# EAGLE design video-max5-sram (EAGLE 5.11)
DRAWN_BY: AlexiosC; PROJECT_NAME: CFT Mini-Computer VDU Card; REVISION: Draft, pre-alpha; SHEET_DESCRIPTION: Frame State Machine; SIMULATION_FILENAME: video.v; URL: http://www.bedroomlan.org/cft

## Sheet 1 of 3
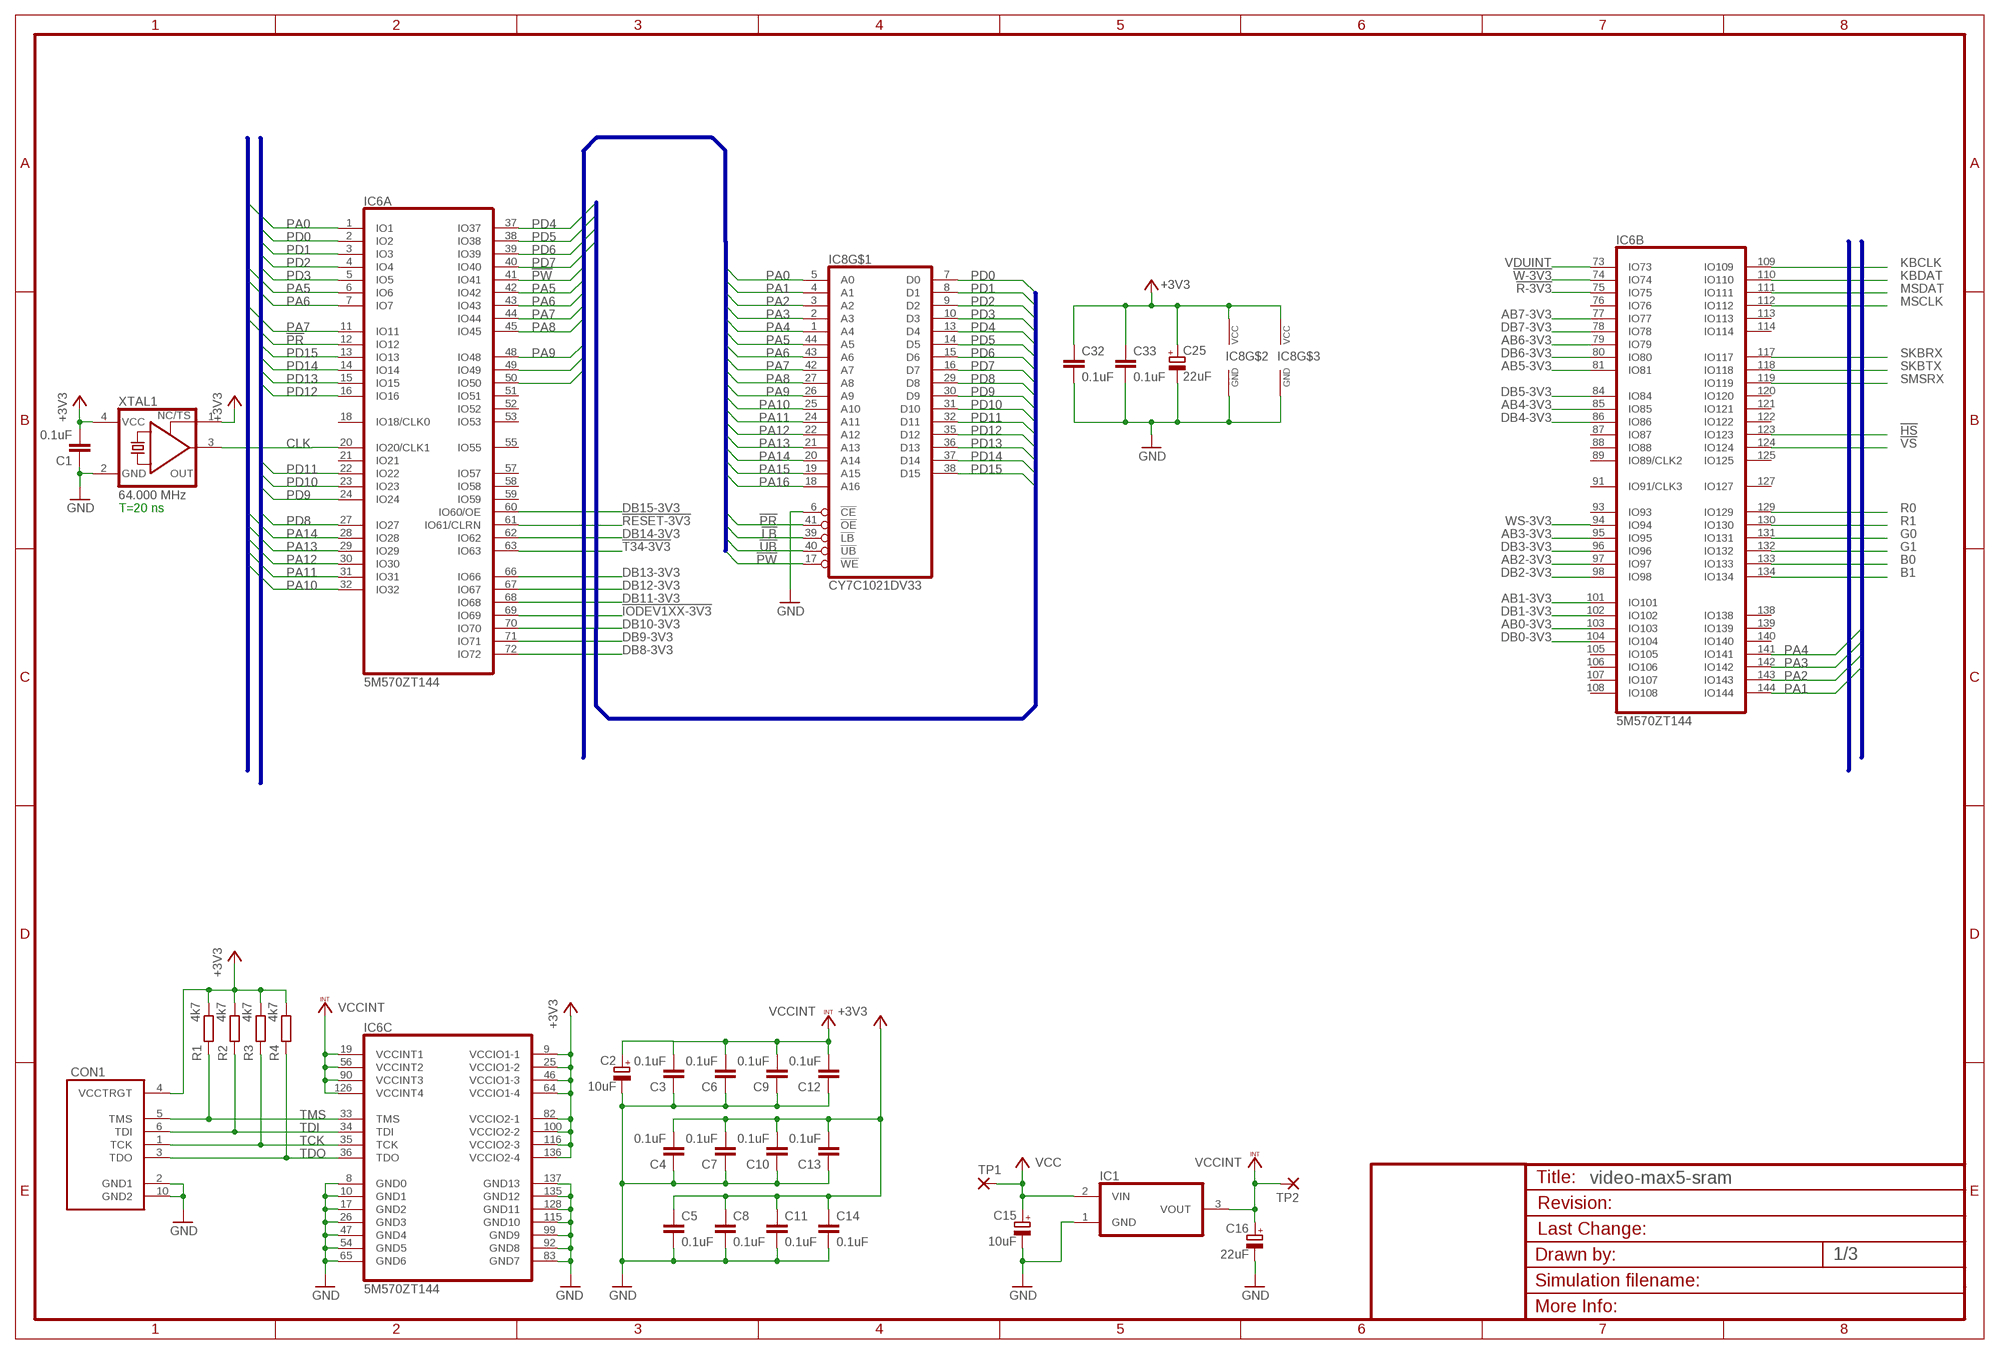
[diagram p0: schematic, sheet 1]

### Parts
C1  0.1uF  C-EUC0805K  [C0805K]
C2  10uF  CPOL-EUE2-5  [E2-5]
C3  0.1uF  C-EUC0805K  [C0805K]
C4  0.1uF  C-EUC0805K  [C0805K]
C5  0.1uF  C-EUC0805K  [C0805K]
C6  0.1uF  C-EUC0805K  [C0805K]
C7  0.1uF  C-EUC0805K  [C0805K]
C8  0.1uF  C-EUC0805K  [C0805K]
C9  0.1uF  C-EUC0805K  [C0805K]
C10  0.1uF  C-EUC0805K  [C0805K]
C11  0.1uF  C-EUC0805K  [C0805K]
C12  0.1uF  C-EUC0805K  [C0805K]
C13  0.1uF  C-EUC0805K  [C0805K]
C14  0.1uF  C-EUC0805K  [C0805K]
C15  10uF  CPOL-EUE2-5  [E2-5]
C16  22uF  CPOL-EUE2-5  [E2-5]
C25  22uF  CPOL-EUE2-5  [E2-5]
C32  0.1uF  C-EUC0805K  [C0805K]
C33  0.1uF  C-EUC0805K  [C0805K]
CON1  JTAG-ALTERA  [SHROUDED-HEADER-2X5-2.5MM]
IC1  AP1117D18  [TO252]
IC6  5M570ZT144  [TQFP144]
IC8  CY7C1021DV33  IS61VL12816L-10T  [TSOP44-T2]
R1  4k7  R-EU_R0805W  [R0805W]
R2  4k7  R-EU_R0805W  [R0805W]
R3  4k7  R-EU_R0805W  [R0805W]
R4  4k7  R-EU_R0805W  [R0805W]
TP1  2,54/0,8  [2,54/0,8]
TP2  2,54/0,8  [2,54/0,8]
XTAL1  64.000 MHz  XO-SMD-5X3.2  [CRYSTAL-SMD-5X3.2MM]

### Nets
!HS: IC6.123(B:IO123) ; also sheet 2
!IODEV1XX-3V3: IC6.69(A:IO69) ; also sheet 2
!LB: IC6.50(A:IO50) IC8.39(!LB)
!PR: IC6.12(A:IO12) IC8.41(!OE)
!PW: IC6.41(A:IO41) IC8.17(!WE)
!R-3V3: IC6.75(B:IO75) ; also sheet 2
!RESET-3V3: IC6.61(A:IO61/CLRN) ; also sheet 2
!T34-3V3: IC6.63(A:IO63)
!UB: IC6.49(A:IO49) IC8.40(!UB)
!VS: IC6.124(B:IO124) ; also sheet 2
!W-3V3: IC6.74(B:IO74) ; also sheet 2
+3V3: C1.2 C4.2 C5.1 C7.2 C8.1 C10.2 C11.1 C13.2 C14.1 C25.+ C32.1 C33.1 CON1.4(VCCTRGT) IC6.9(C:VCCIO1-1) IC6.25(C:VCCIO1-2) IC6.46(C:VCCIO1-3) IC6.64(C:VCCIO1-4) IC6.82(C:VCCIO2-1) IC6.100(C:VCCIO2-2) IC6.116(C:VCCIO2-3) IC6.136(C:VCCIO2-4) IC8.11(VCC) IC8.33(VCC) R1.2 R2.2 R3.2 R4.2 XTAL1.1(TS) XTAL1.4(VCC) ; also sheet 2,3
AB0-3V3: IC6.103(B:IO103) ; also sheet 2
AB1-3V3: IC6.101(B:IO101) ; also sheet 2
AB2-3V3: IC6.97(B:IO97) ; also sheet 2
AB3-3V3: IC6.95(B:IO95) ; also sheet 2
AB4-3V3: IC6.85(B:IO85) ; also sheet 2
AB5-3V3: IC6.81(B:IO81) ; also sheet 2
AB6-3V3: IC6.79(B:IO79) ; also sheet 2
AB7-3V3: IC6.77(B:IO77) ; also sheet 2
B0: IC6.133(B:IO133) ; also sheet 2
B1: IC6.134(B:IO134) ; also sheet 2
CLK: IC6.20(A:IO20/CLK1) XTAL1.3(OUT)
DB0-3V3: IC6.104(B:IO104) ; also sheet 2
DB1-3V3: IC6.102(B:IO102) ; also sheet 2
DB2-3V3: IC6.98(B:IO98) ; also sheet 2
DB3-3V3: IC6.96(B:IO96) ; also sheet 2
DB4-3V3: IC6.86(B:IO86) ; also sheet 2
DB5-3V3: IC6.84(B:IO84) ; also sheet 2
DB6-3V3: IC6.80(B:IO80) ; also sheet 2
DB7-3V3: IC6.78(B:IO78) ; also sheet 2
DB8-3V3: IC6.72(A:IO72) ; also sheet 2
DB9-3V3: IC6.71(A:IO71) ; also sheet 2
DB10-3V3: IC6.70(A:IO70) ; also sheet 2
DB11-3V3: IC6.68(A:IO68) ; also sheet 2
DB12-3V3: IC6.67(A:IO67) ; also sheet 2
DB13-3V3: IC6.66(A:IO66) ; also sheet 2
DB14-3V3: IC6.62(A:IO62) ; also sheet 2
DB15-3V3: IC6.60(A:IO60/OE) ; also sheet 2
G0: IC6.131(B:IO131) ; also sheet 2
G1: IC6.132(B:IO132) ; also sheet 2
GND: C1.1 C2.- C3.1 C4.1 C5.2 C6.1 C7.1 C8.2 C9.1 C10.1 C11.2 C12.1 C13.1 C14.2 C15.- C16.- C25.- C32.2 C33.2 CON1.2(GND1) CON1.10(GND2) IC1.1(GND) IC6.8(C:GND0) IC6.10(C:GND1) IC6.17(C:GND2) IC6.26(C:GND3) IC6.47(C:GND4) IC6.54(C:GND5) IC6.65(C:GND6) IC6.83(C:GND7) IC6.92(C:GND8) IC6.99(C:GND9) IC6.115(C:GND10) IC6.128(C:GND11) IC6.135(C:GND12) IC6.137(C:GND13) IC8.6(!CE) IC8.12(GND) IC8.34(GND) XTAL1.2(GND) ; also sheet 2,3
KBCLK: IC6.109(B:IO109) ; also sheet 2
KBDAT: IC6.110(B:IO110) ; also sheet 2
MSCLK: IC6.112(B:IO112) ; also sheet 2
MSDAT: IC6.111(B:IO111) ; also sheet 2
PA0: IC6.1(A:IO1) IC8.5(A0)
PA1: IC6.144(B:IO144) IC8.4(A1)
PA2: IC6.143(B:IO143) IC8.3(A2)
PA3: IC6.142(B:IO142) IC8.2(A3)
PA4: IC6.141(B:IO141) IC8.1(A4)
PA5: IC6.6(A:IO6) IC6.42(A:IO42) IC8.44(A5)
PA6: IC6.7(A:IO7) IC6.43(A:IO43) IC8.43(A6)
PA7: IC6.11(A:IO11) IC6.44(A:IO44) IC8.42(A7)
PA8: IC6.45(A:IO45) IC8.27(A8)
PA9: IC6.48(A:IO48) IC8.26(A9)
PA10: IC6.32(A:IO32) IC8.25(A10)
PA11: IC6.31(A:IO31) IC8.24(A11)
PA12: IC6.30(A:IO30) IC8.22(A12)
PA13: IC6.29(A:IO29) IC8.21(A13)
PA14: IC6.28(A:IO28) IC8.20(A14)
PA15: IC8.19(A15)
PA16: IC8.18(A16)
PD0: IC6.2(A:IO2) IC8.7(D0)
PD1: IC6.3(A:IO3) IC8.8(D1)
PD2: IC6.4(A:IO4) IC8.9(D2)
PD3: IC6.5(A:IO5) IC8.10(D3)
PD4: IC6.37(A:IO37) IC8.13(D4)
PD5: IC6.38(A:IO38) IC8.14(D5)
PD6: IC6.39(A:IO39) IC8.15(D6)
PD7: IC6.40(A:IO40) IC8.16(D7)
PD8: IC6.27(A:IO27) IC8.29(D8)
PD9: IC6.24(A:IO24) IC8.30(D9)
PD10: IC6.23(A:IO23) IC8.31(D10)
PD11: IC6.22(A:IO22) IC8.32(D11)
PD12: IC6.16(A:IO16) IC8.35(D12)
PD13: IC6.15(A:IO15) IC8.36(D13)
PD14: IC6.14(A:IO14) IC8.37(D14)
PD15: IC6.13(A:IO13) IC8.38(D15)
R0: IC6.129(B:IO129) ; also sheet 2
R1: IC6.130(B:IO130) ; also sheet 2
SKBRX: IC6.117(B:IO117) ; also sheet 2
SKBTX: IC6.118(B:IO118) ; also sheet 2
SMSRX: IC6.119(B:IO119) ; also sheet 2
TCK: CON1.1(TCK) IC6.35(C:TCK) R3.1
TDI: CON1.6(TDI) IC6.34(C:TDI) R2.1
TDO: CON1.3(TDO) IC6.36(C:TDO) R4.1
TMS: CON1.5(TMS) IC6.33(C:TMS) R1.1
VCC: C15.+ IC1.2(VIN) TP1.1(P) ; also sheet 2,3
VCCINT: C2.+ C3.2 C6.2 C9.2 C12.2 C16.+ IC1.3(VOUT) IC6.19(C:VCCINT1) IC6.56(C:VCCINT2) IC6.90(C:VCCINT3) IC6.126(C:VCCINT4) TP2.1(P)
VDUINT: IC6.73(B:IO73) ; also sheet 2
WS-3V3: IC6.94(B:IO94) ; also sheet 2
Unconnected: IC6.18(A:IO18/CLK0) IC6.21(A:IO21) IC6.51(A:IO51) IC6.52(A:IO52) IC6.53(A:IO53) IC6.55(A:IO55) IC6.57(A:IO57) IC6.58(A:IO58) IC6.59(A:IO59) IC6.76(B:IO76) IC6.87(B:IO87) IC6.88(B:IO88) IC6.89(B:IO89/CLK2) IC6.91(B:IO91/CLK3) IC6.93(B:IO93) IC6.105(B:IO105) IC6.106(B:IO106) IC6.107(B:IO107) IC6.108(B:IO108) IC6.113(B:IO113) IC6.114(B:IO114) IC6.120(B:IO120) IC6.121(B:IO121) IC6.122(B:IO122) IC6.125(B:IO125) IC6.127(B:IO127) IC6.138(B:IO138) IC6.139(B:IO139) IC6.140(B:IO140)

### Buses
PD[0..23]
PA[0..15],PB/!PC!,CG/!P!,!PR,!PW
PA[0..16],!PR,!PW,!UB,!LB,!CE1,!CE2

### Notes on the sheet
- T=20 ns

## Sheet 2 of 3
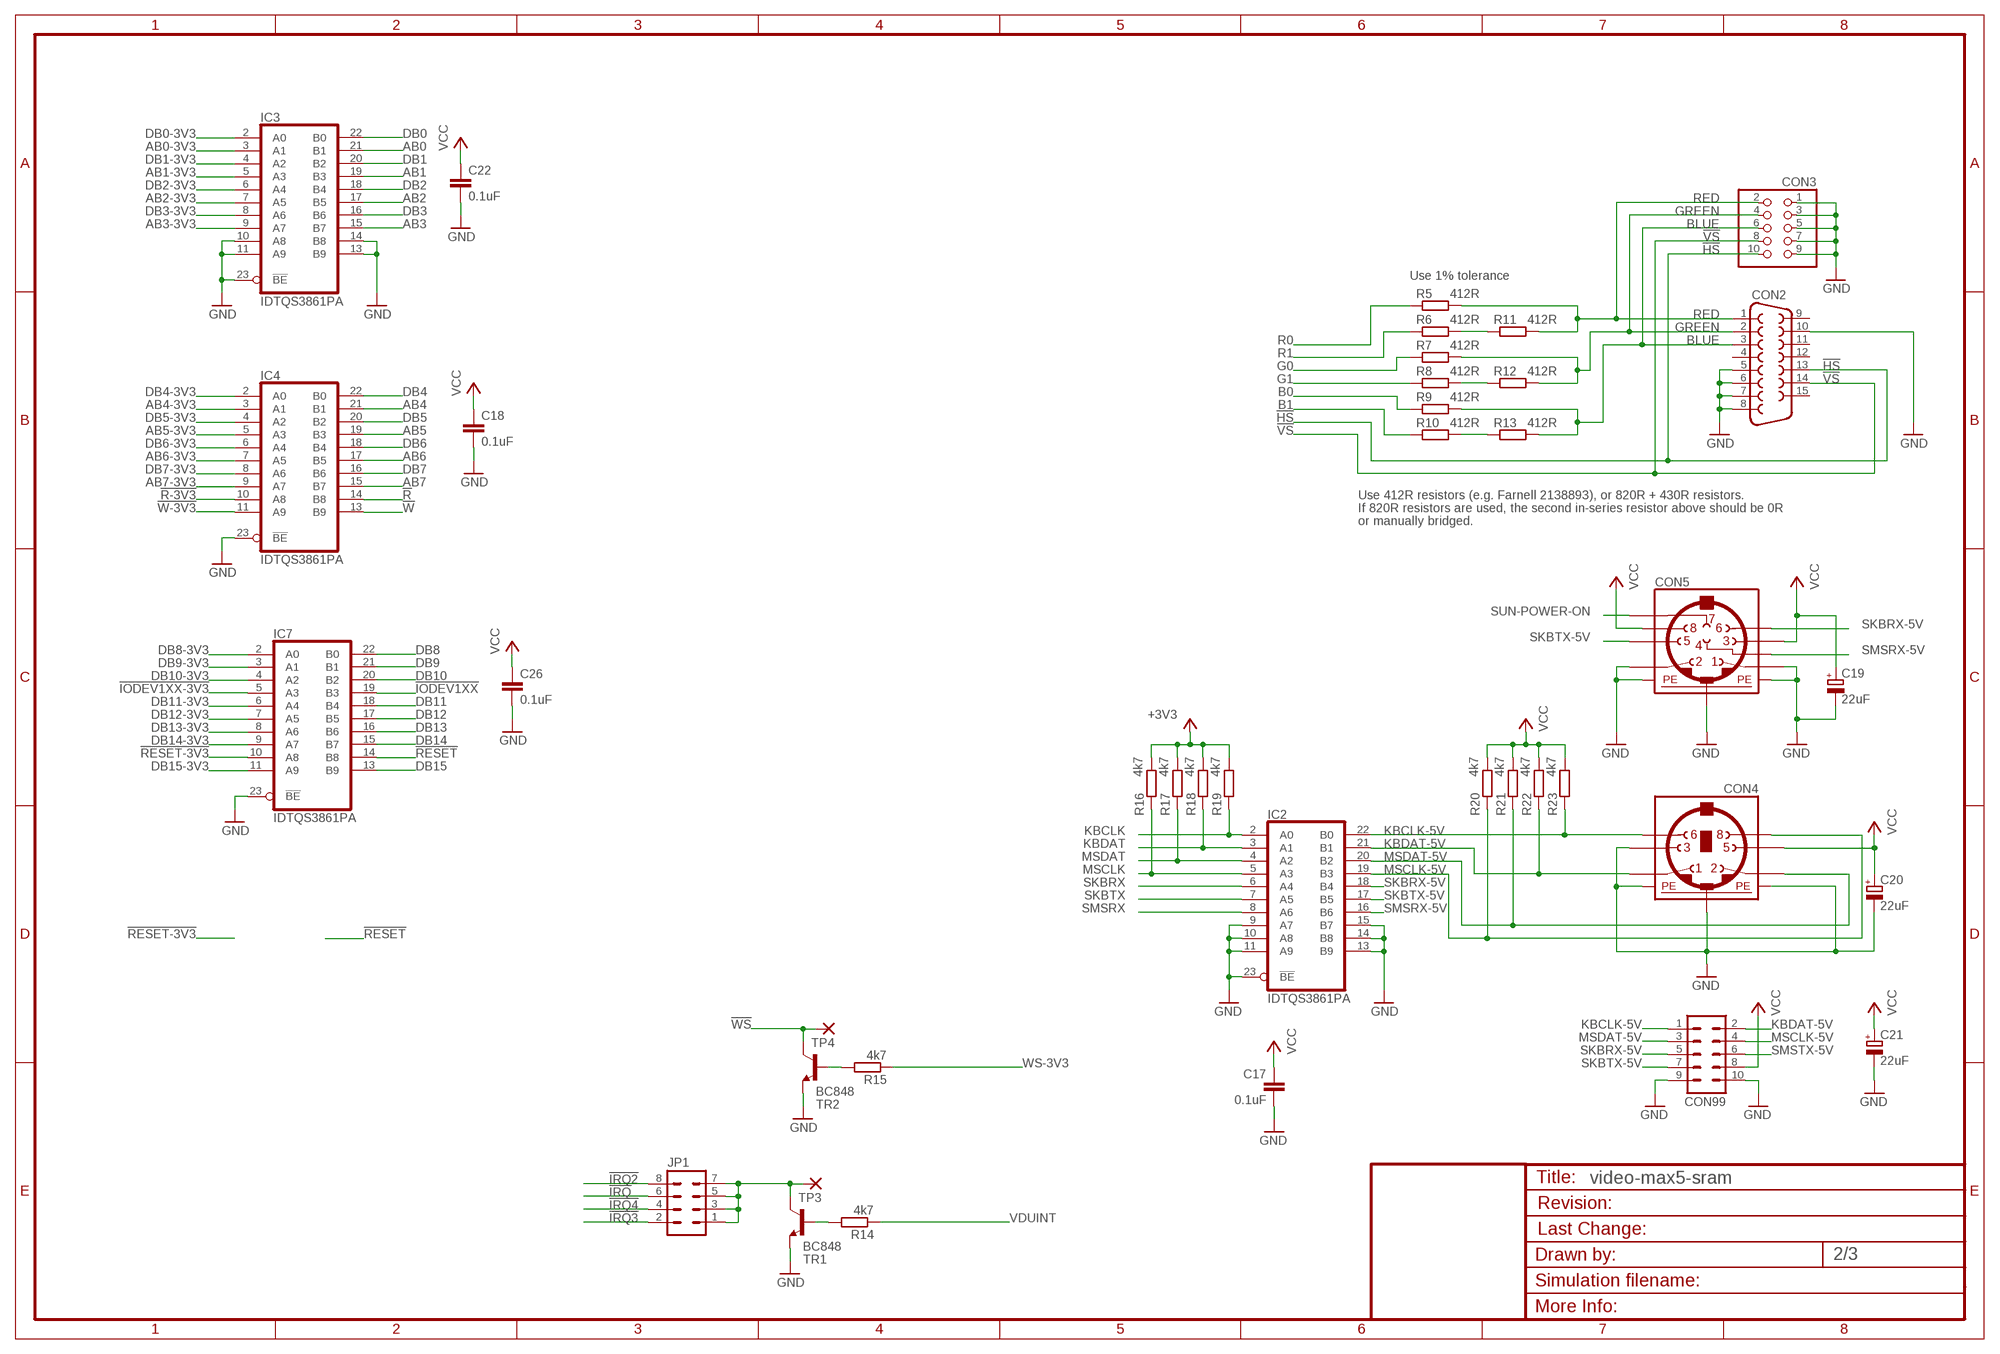
[diagram p1: schematic, sheet 2]

### Parts
C17  0.1uF  C-EUC0805K  [C0805K]
C18  0.1uF  C-EUC0805K  [C0805K]
C19  22uF  CPOL-EUE2-5  [E2-5]
C20  22uF  CPOL-EUE2-5  [E2-5]
C21  22uF  CPOL-EUE2-5  [E2-5]
C22  0.1uF  C-EUC0805K  [C0805K]
C26  0.1uF  C-EUC0805K  [C0805K]
CON2  F15HDH  [HDF15H]
CON3  PINHD-2X5  [2X05]
CON4  MINI_DIN_6  [M_DIN6]
CON5  MINI_DIN_8  [M_DIN8]
CON99  MA05-2  [MA05-2]
IC2  IDTQS3861PA  [TSSOP24]
IC3  IDTQS3861PA  [TSSOP24]
IC4  IDTQS3861PA  [TSSOP24]
IC7  IDTQS3861PA  [TSSOP24]
JP1  MA04-2  [MA04-2]
R5  412R  R-EU_R0805W  [R0805W]
R6  412R  R-EU_R0805W  [R0805W]
R7  412R  R-EU_R0805W  [R0805W]
R8  412R  R-EU_R0805W  [R0805W]
R9  412R  R-EU_R0805W  [R0805W]
R10  412R  R-EU_R0805W  [R0805W]
R11  412R  R-EU_R0805W  [R0805W]
R12  412R  R-EU_R0805W  [R0805W]
R13  412R  R-EU_R0805W  [R0805W]
R14  4k7  R-EU_R0805W  [R0805W]
R15  4k7  R-EU_R0805W  [R0805W]
R16  4k7  R-EU_R0805W  [R0805W]
R17  4k7  R-EU_R0805W  [R0805W]
R18  4k7  R-EU_R0805W  [R0805W]
R19  4k7  R-EU_R0805W  [R0805W]
R20  4k7  R-EU_R0805W  [R0805W]
R21  4k7  R-EU_R0805W  [R0805W]
R22  4k7  R-EU_R0805W  [R0805W]
R23  4k7  R-EU_R0805W  [R0805W]
TP3  2,54/0,8  [2,54/0,8]
TP4  2,54/0,8  [2,54/0,8]
TR1  BC848  [SOT23]
TR2  BC848  [SOT23]

### Nets
!HS: CON2.13 CON3.10 ; also sheet 1
!IODEV1XX: IC7.19(B3) ; also sheet 3
!IODEV1XX-3V3: IC7.5(A3) ; also sheet 1
!IRQ: JP1.6 ; also sheet 3
!IRQ2: JP1.8 ; also sheet 3
!IRQ3: JP1.2 ; also sheet 3
!IRQ4: JP1.4 ; also sheet 3
!R: IC4.14(B8) ; also sheet 3
!R-3V3: IC4.10(A8) ; also sheet 1
!RESET: IC7.14(B8) ; also sheet 3
!RESET-3V3: IC7.10(A8) ; also sheet 1
!VS: CON2.14 CON3.8 ; also sheet 1
!W: IC4.13(B9) ; also sheet 3
!W-3V3: IC4.11(A9) ; also sheet 1
!WS: TP4.1(P) TR2.3(C) ; also sheet 3
+3V3: R16.2 R17.2 R18.2 R19.2 ; also sheet 1,3
AB0: IC3.21(B1) ; also sheet 3
AB0-3V3: IC3.3(A1) ; also sheet 1
AB1: IC3.19(B3) ; also sheet 3
AB1-3V3: IC3.5(A3) ; also sheet 1
AB2: IC3.17(B5) ; also sheet 3
AB2-3V3: IC3.7(A5) ; also sheet 1
AB3: IC3.15(B7) ; also sheet 3
AB3-3V3: IC3.9(A7) ; also sheet 1
AB4: IC4.21(B1) ; also sheet 3
AB4-3V3: IC4.3(A1) ; also sheet 1
AB5: IC4.19(B3) ; also sheet 3
AB5-3V3: IC4.5(A3) ; also sheet 1
AB6: IC4.17(B5) ; also sheet 3
AB6-3V3: IC4.7(A5) ; also sheet 1
AB7: IC4.15(B7) ; also sheet 3
AB7-3V3: IC4.9(A7) ; also sheet 1
B0: R9.1 ; also sheet 1
B1: R10.1 ; also sheet 1
BLUE [Analogue]: CON2.3 CON3.6 R9.2 R13.2
DB0: IC3.22(B0) ; also sheet 3
DB0-3V3: IC3.2(A0) ; also sheet 1
DB1: IC3.20(B2) ; also sheet 3
DB1-3V3: IC3.4(A2) ; also sheet 1
DB2: IC3.18(B4) ; also sheet 3
DB2-3V3: IC3.6(A4) ; also sheet 1
DB3: IC3.16(B6) ; also sheet 3
DB3-3V3: IC3.8(A6) ; also sheet 1
DB4: IC4.22(B0) ; also sheet 3
DB4-3V3: IC4.2(A0) ; also sheet 1
DB5: IC4.20(B2) ; also sheet 3
DB5-3V3: IC4.4(A2) ; also sheet 1
DB6: IC4.18(B4) ; also sheet 3
DB6-3V3: IC4.6(A4) ; also sheet 1
DB7: IC4.16(B6) ; also sheet 3
DB7-3V3: IC4.8(A6) ; also sheet 1
DB8: IC7.22(B0) ; also sheet 3
DB8-3V3: IC7.2(A0) ; also sheet 1
DB9: IC7.21(B1) ; also sheet 3
DB9-3V3: IC7.3(A1) ; also sheet 1
DB10: IC7.20(B2) ; also sheet 3
DB10-3V3: IC7.4(A2) ; also sheet 1
DB11: IC7.18(B4) ; also sheet 3
DB11-3V3: IC7.6(A4) ; also sheet 1
DB12: IC7.17(B5) ; also sheet 3
DB12-3V3: IC7.7(A5) ; also sheet 1
DB13: IC7.16(B6) ; also sheet 3
DB13-3V3: IC7.8(A6) ; also sheet 1
DB14: IC7.15(B7) ; also sheet 3
DB14-3V3: IC7.9(A7) ; also sheet 1
DB15: IC7.13(B9) ; also sheet 3
DB15-3V3: IC7.11(A9) ; also sheet 1
G0: R7.1 ; also sheet 1
G1: R8.1 ; also sheet 1
GND: C17.2 C18.2 C19.- C20.- C21.- C22.2 C26.2 CON2.5 CON2.6 CON2.7 CON2.8 CON2.10 CON3.1 CON3.3 CON3.5 CON3.7 CON3.9 CON4.3 CON4.SH1(PE1) CON4.SH2(PE2) CON4.SH3(PE3) CON5.1 CON5.2 CON5.SH1(PE1) CON5.SH2(PE2) CON5.SH3(PE3) CON99.9 CON99.10 IC2.9(A7) IC2.10(A8) IC2.11(A9) IC2.13(B9) IC2.14(B8) IC2.15(B7) IC2.23(!BE) IC3.10(A8) IC3.11(A9) IC3.13(B9) IC3.14(B8) IC3.23(!BE) IC4.23(!BE) IC7.23(!BE) TR1.2(E) TR2.2(E) ; also sheet 1,3
GREEN [Analogue]: CON2.2 CON3.4 R7.2 R12.2
KBCLK: IC2.2(A0) R19.1 ; also sheet 1
KBCLK-5V: CON4.6 CON99.1 IC2.22(B0) R23.1
KBDAT: IC2.3(A1) R18.1 ; also sheet 1
KBDAT-5V: CON4.1 CON99.2 IC2.21(B1) R22.1
MSCLK: IC2.5(A3) R16.1 ; also sheet 1
MSCLK-5V: CON4.8 CON99.4 IC2.19(B3) R20.1
MSDAT: IC2.4(A2) R17.1 ; also sheet 1
MSDAT-5V: CON4.2 CON99.3 IC2.20(B2) R21.1
N$1: R6.2 R11.1
N$2: R8.2 R12.1
N$3: R10.2 R13.1
N$6: R15.2 TR2.1(B)
N$260: JP1.1 JP1.3 JP1.5 JP1.7 TP3.1(P) TR1.3(C)
N$843: R14.2 TR1.1(B)
R0: R5.1 ; also sheet 1
R1: R6.1 ; also sheet 1
RED [Analogue]: CON2.1 CON3.2 R5.2 R11.2
SKBRX: IC2.6(A4) ; also sheet 1
SKBRX-5V: CON5.6 CON99.5 IC2.18(B4)
SKBTX: IC2.7(A5) ; also sheet 1
SKBTX-5V: CON5.5 CON99.7 IC2.17(B5)
SMSRX: IC2.8(A6) ; also sheet 1
SMSRX-5V: CON5.4 IC2.16(B6)
SMSTX-5V: CON99.6
SUN-POWER-ON: CON5.7
VCC: C17.1 C18.1 C19.+ C20.+ C21.+ C22.1 C26.1 CON4.5 CON5.3 CON5.8 CON99.8 R20.2 R21.2 R22.2 R23.2 ; also sheet 1,3
VDUINT: R14.1 ; also sheet 1
WS-3V3: R15.1 ; also sheet 1
Unconnected: CON2.4 CON2.9 CON2.11 CON2.12 CON2.15

### Notes on the sheet
- Use 1% tolerance
- Use 412R resistors (e.g. Farnell 2138893), or 820R + 430R resistors.
- If 820R resistors are used, the second in-series resistor above should be 0R
- or manually bridged.

## Sheet 3 of 3
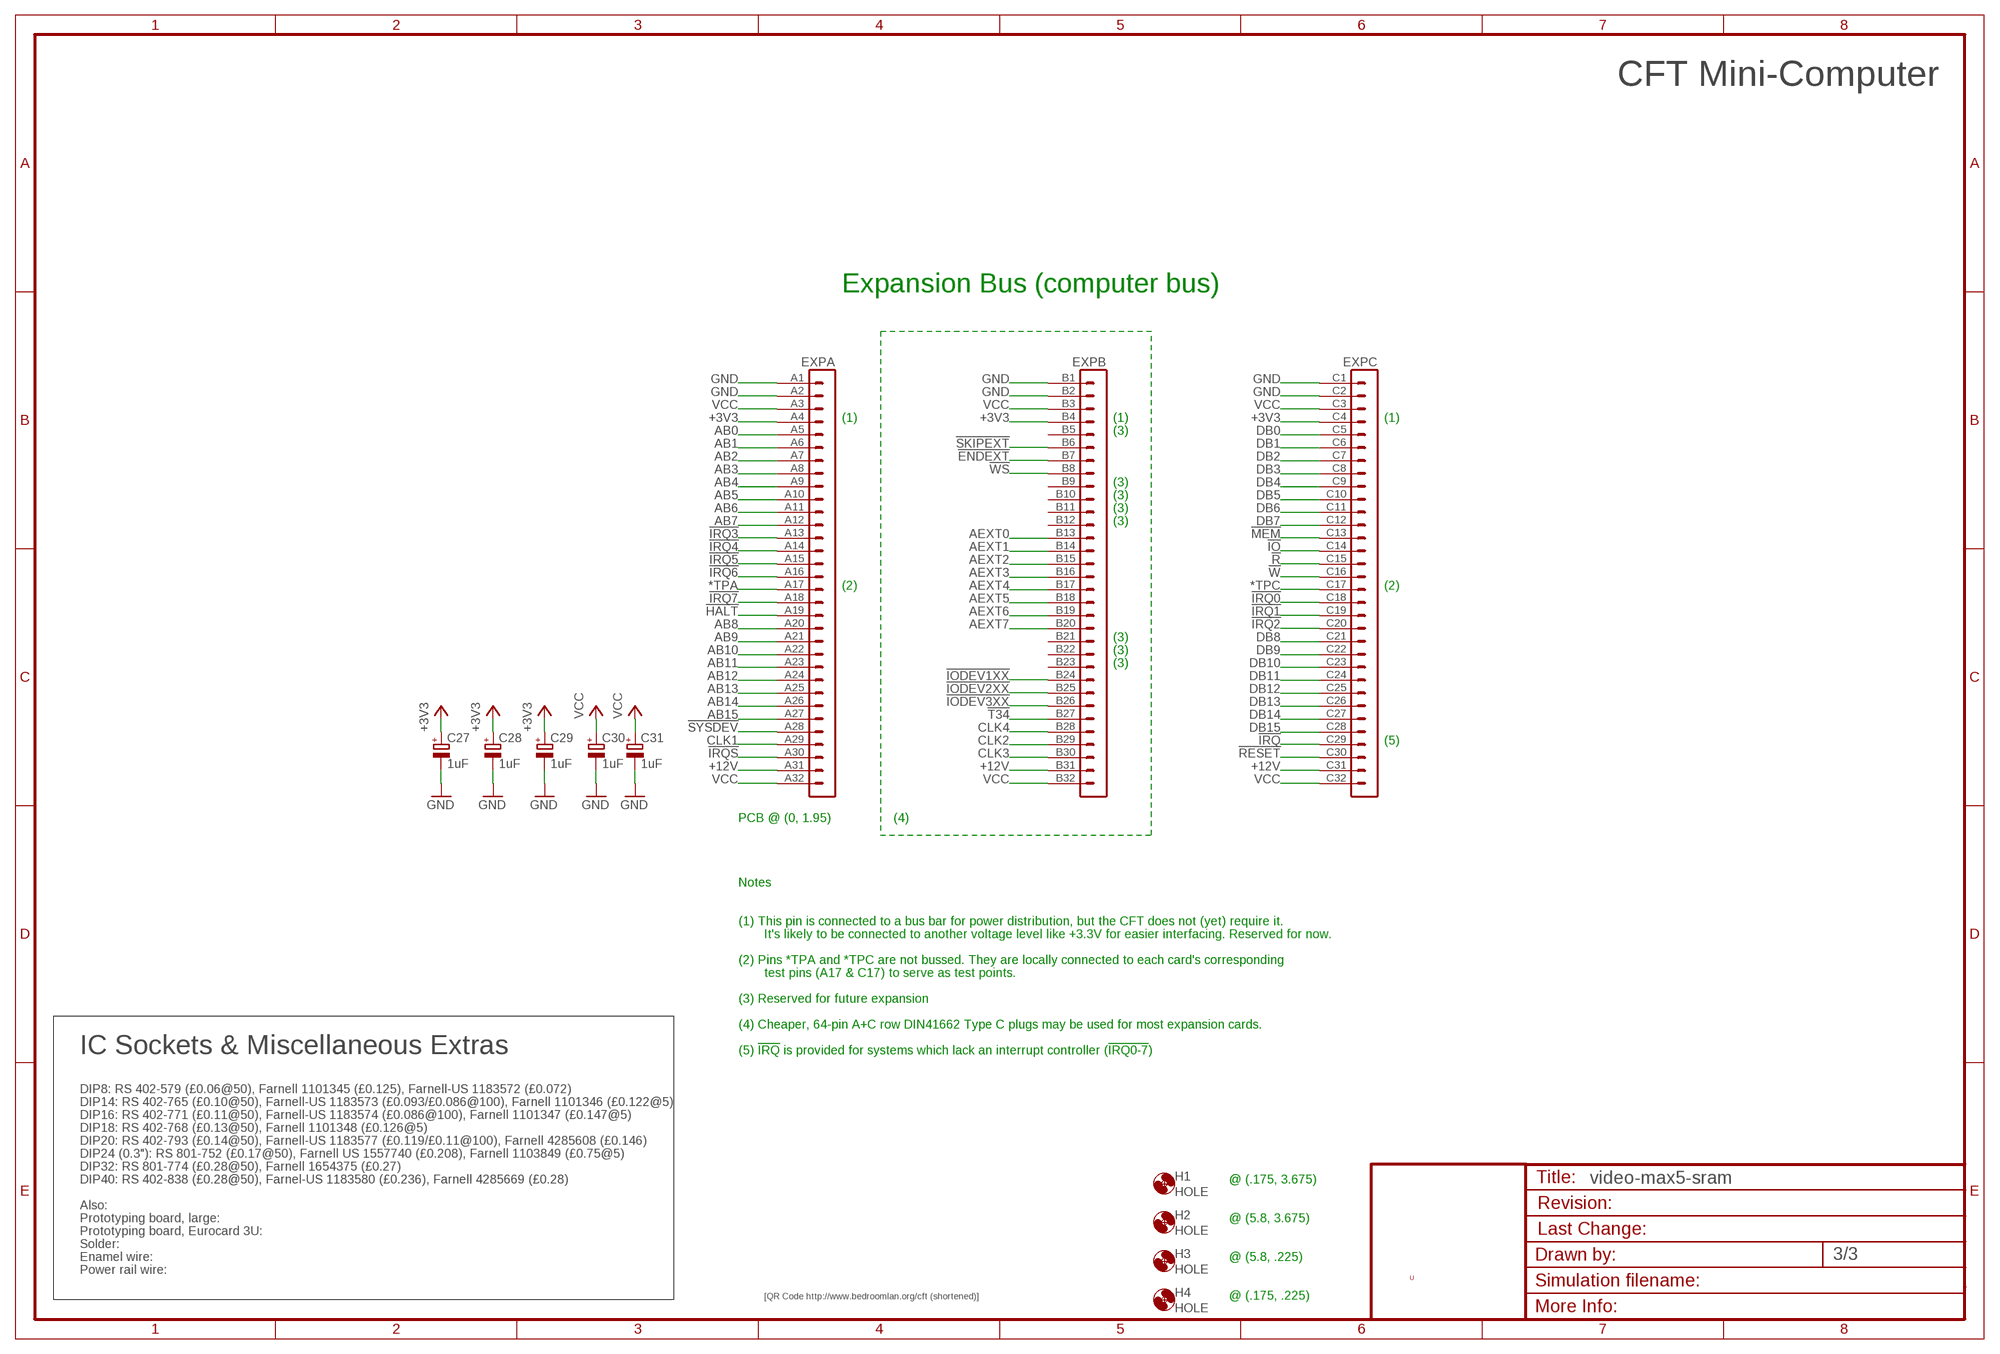
[diagram p2: schematic, sheet 3]

### Parts
C27  1uF  CPOL-EUE2.5-5  [E2,5-5]
C28  1uF  CPOL-EUE2.5-5  [E2,5-5]
C29  1uF  CPOL-EUE2.5-5  [E2,5-5]
C30  1uF  CPOL-EUE2.5-5  [E2,5-5]
C31  1uF  CPOL-EUE2.5-5  [E2,5-5]
EXP  VG96-3K  [VG96K]
H1  HOLE  [STANDOFF_28_60]
H2  HOLE  [STANDOFF_28_60]
H3  HOLE  [STANDOFF_28_60]
H4  HOLE  [STANDOFF_28_60]
U$2  QRCODE-CFT  [CFT-QRCODE]

### Nets
!ENDEXT: EXP.B7
!HALT: EXP.A19
!IO: EXP.C14
!IODEV1XX: EXP.B24 ; also sheet 2
!IODEV2XX: EXP.B25
!IODEV3XX: EXP.B26
!IRQ: EXP.C29 ; also sheet 2
!IRQ0: EXP.C18
!IRQ1: EXP.C19
!IRQ2: EXP.C20 ; also sheet 2
!IRQ3: EXP.A13 ; also sheet 2
!IRQ4: EXP.A14 ; also sheet 2
!IRQ5: EXP.A15
!IRQ6: EXP.A16
!IRQ7: EXP.A18
!IRQS: EXP.A30
!MEM: EXP.C13
!R: EXP.C15 ; also sheet 2
!RESET: EXP.C30 ; also sheet 2
!SKIPEXT: EXP.B6
!SYSDEV: EXP.A28
!T34: EXP.B27
!W: EXP.C16 ; also sheet 2
!WS: EXP.B8 ; also sheet 2
*TPA: EXP.A17
*TPC: EXP.C17
+3V3: C27.+ C28.+ C29.+ EXP.A4 EXP.B4 EXP.C4 ; also sheet 1,2
+12V [LED power]: EXP.A31 EXP.B31 EXP.C31
AB0: EXP.A5 ; also sheet 2
AB1: EXP.A6 ; also sheet 2
AB2: EXP.A7 ; also sheet 2
AB3: EXP.A8 ; also sheet 2
AB4: EXP.A9 ; also sheet 2
AB5: EXP.A10 ; also sheet 2
AB6: EXP.A11 ; also sheet 2
AB7: EXP.A12 ; also sheet 2
AB8: EXP.A20
AB9: EXP.A21
AB10: EXP.A22
AB11: EXP.A23
AB12: EXP.A24
AB13: EXP.A25
AB14: EXP.A26
AB15: EXP.A27
AEXT0: EXP.B13
AEXT1: EXP.B14
AEXT2: EXP.B15
AEXT3: EXP.B16
AEXT4: EXP.B17
AEXT5: EXP.B18
AEXT6: EXP.B19
AEXT7: EXP.B20
CLK1: EXP.A29
CLK2: EXP.B29
CLK3: EXP.B30
CLK4: EXP.B28
DB0: EXP.C5 ; also sheet 2
DB1: EXP.C6 ; also sheet 2
DB2: EXP.C7 ; also sheet 2
DB3: EXP.C8 ; also sheet 2
DB4: EXP.C9 ; also sheet 2
DB5: EXP.C10 ; also sheet 2
DB6: EXP.C11 ; also sheet 2
DB7: EXP.C12 ; also sheet 2
DB8: EXP.C21 ; also sheet 2
DB9: EXP.C22 ; also sheet 2
DB10: EXP.C23 ; also sheet 2
DB11: EXP.C24 ; also sheet 2
DB12: EXP.C25 ; also sheet 2
DB13: EXP.C26 ; also sheet 2
DB14: EXP.C27 ; also sheet 2
DB15: EXP.C28 ; also sheet 2
GND: C27.- C28.- C29.- C30.- C31.- EXP.A1 EXP.A2 EXP.B1 EXP.B2 EXP.C1 EXP.C2 ; also sheet 1,2
VCC: C30.+ C31.+ EXP.A3 EXP.A32 EXP.B3 EXP.B32 EXP.C3 EXP.C32 ; also sheet 1,2
Unconnected: EXP.B5 EXP.B9 EXP.B10 EXP.B11 EXP.B12 EXP.B21 EXP.B22 EXP.B23

### Notes on the sheet
- CFT Mini-Computer
- Expansion Bus (computer bus)
- (1) | (1) | (1)
- (3)
- (3)
- (3)
- (3)
- (3)
- (2) | (2)
- (3)
- (3)
- (3)
- (5)
- PCB @ (0, 1.95) | (4)
- Notes
- (1) This pin is connected to a bus bar for power distribution, but the CFT does not (yet) require it.
- It's likely to be connected to another voltage level like +3.3V for easier interfacing. Reserved for now.
- (2) Pins *TPA and *TPC are not bussed. They are locally connected to each card's corresponding
- test pins (A17 & C17) to serve as test points.
- (3) Reserved for future expansion
- (4) Cheaper, 64-pin A+C row DIN41662 Type C plugs may be used for most expansion cards.
- IC Sockets & Miscellaneous Extras | (5) !IRQ! is provided for systems which lack an interrupt controller (!IRQ0-7!)
- DIP8: RS 402-579 (£0.06@50), Farnell 1101345 (£0.125), Farnell-US 1183572 (£0.072)
- DIP14: RS 402-765 (£0.10@50), Farnell-US 1183573 (£0.093/£0.086@100), Farnell 1101346 (£0.122@5)
- DIP16: RS 402-771 (£0.11@50), Farnell-US 1183574 (£0.086@100), Farnell 1101347 (£0.147@5)
- DIP18: RS 402-768 (£0.13@50), Farnell 1101348 (£0.126@5)
- DIP20: RS 402-793 (£0.14@50), Farnell-US 1183577 (£0.119/£0.11@100), Farnell 4285608 (£0.146)
- DIP24 (0.3"): RS 801-752 (£0.17@50), Farnell US 1557740 (£0.208), Farnell 1103849 (£0.75@5)
- DIP32: RS 801-774 (£0.28@50), Farnell 1654375 (£0.27)
- DIP40: RS 402-838 (£0.28@50), Farnel-US 1183580 (£0.236), Farnell 4285669 (£0.28) | @ (.175, 3.675)
- Also:
- Prototyping board, large: | @ (5.8, 3.675)
- Prototyping board, Eurocard 3U:
- Solder:
- Enamel wire: | @ (5.8, .225)
- Power rail wire:
- U
- @ (.175, .225)

## Power pins joined to a net without a drawn wire
GND: IC2.12(GND) IC3.12(GND) IC4.12(GND) IC7.12(GND)
VCC: IC2.24(VCC) IC3.24(VCC) IC4.24(VCC) IC7.24(VCC)

## Library data of the parts
C1 C3-C14 C17 C18 C22 C26 C32 C33 = rcl:C-EU: CAPACITOR, European symbol
C2 C15 C16 C19-C21 C25 C27-C31 = rcl:CPOL-EU: POLARIZED CAPACITOR, European symbol
CON1 = alexios:JTAG-ALTERA
CON2 = con-subd:F15: SUB-D; OC_FARNELL: unknown; OC_NEWARK: unknown
CON3 = pinhead:PINHD-2X5: PIN HEADER
CON4 = mini_din:MINI_DIN_6
CON5 = mini_din:MINI_DIN_8
CON99 = con-lstb:MA05-2: PIN HEADER; OC_FARNELL: unknown; OC_NEWARK: unknown
EXP = alexios-19inch:VG96-3: PCB EUROCARD, 96-pin type C/ABC, 2.54 mm
H1-H4 = alexios:HOLE: Hole for a standoff or mount. Hole diameter: 3.3mm. External Diameter: 6mm.
IC1 = alexios:AP1117: 1A LOW DROPOUT (LDO) POSITIVE FIXED-MODE REGULATOR http://www.farnell.com/datasheets/608751.pdf
IC2-IC4 IC7 = alexios:IDTQS3861: IDT QuickSwitch® High Speed CMOS Bus Switch with Flow-Through Pinout http://www.idt.com/products/memory-logic/bus-switch/50v-quickswitch/qs3861-high-speed-cmos-10-bit-bus-switch-flow-thru-pinout
IC6 = alexios:5M570Z: Altera MAX V CPLD, 570 Logic Elements
IC8 = alexios:IS61VL12816L: 128K x 16 HIGH-SPEED CMOS STATIC RAM WITH 3.3V SUPPLY Datasheet: http://www.mouser.com/ds/2/198/61LV12816L-10208.pdf
JP1 = con-lstb:MA04-2: PIN HEADER; OC_FARNELL: unknown; OC_NEWARK: unknown
R1-R4 R16-R23 = resistor:R-EU_: RESISTOR, European symbol
R5-R15 = rcl:R-EU_: RESISTOR, European symbol
TP1-TP4 = wirepad:2,54/0,8: THROUGH-HOLE PAD
TR1 TR2 = transistor-neu-to92:BC848: NPN TRANSISTOR
U$2 = alexios:QRCODE-*: Various QR codes in silkscreen.
XTAL1 = alexios:XO-: Crystal Oscillator for DIP sockets Crystal oscillators in DIP8 or DIP14 packages with sockets. Drills extra holes on the PCB to allow a standard DIP8 or DIP14 socket to be installed.

## Net classes
0 default: width 0.254 mm, clearance 0.203 mm
1 low power: width 1.27 mm, clearance 0.254 mm
2 LED power: width 1.93 mm, clearance 0.254 mm
3 3.3V power: width 0.61 mm, clearance 0.203 mm
4 Analogue: width 0.406 mm, clearance 0.305 mm

## Board
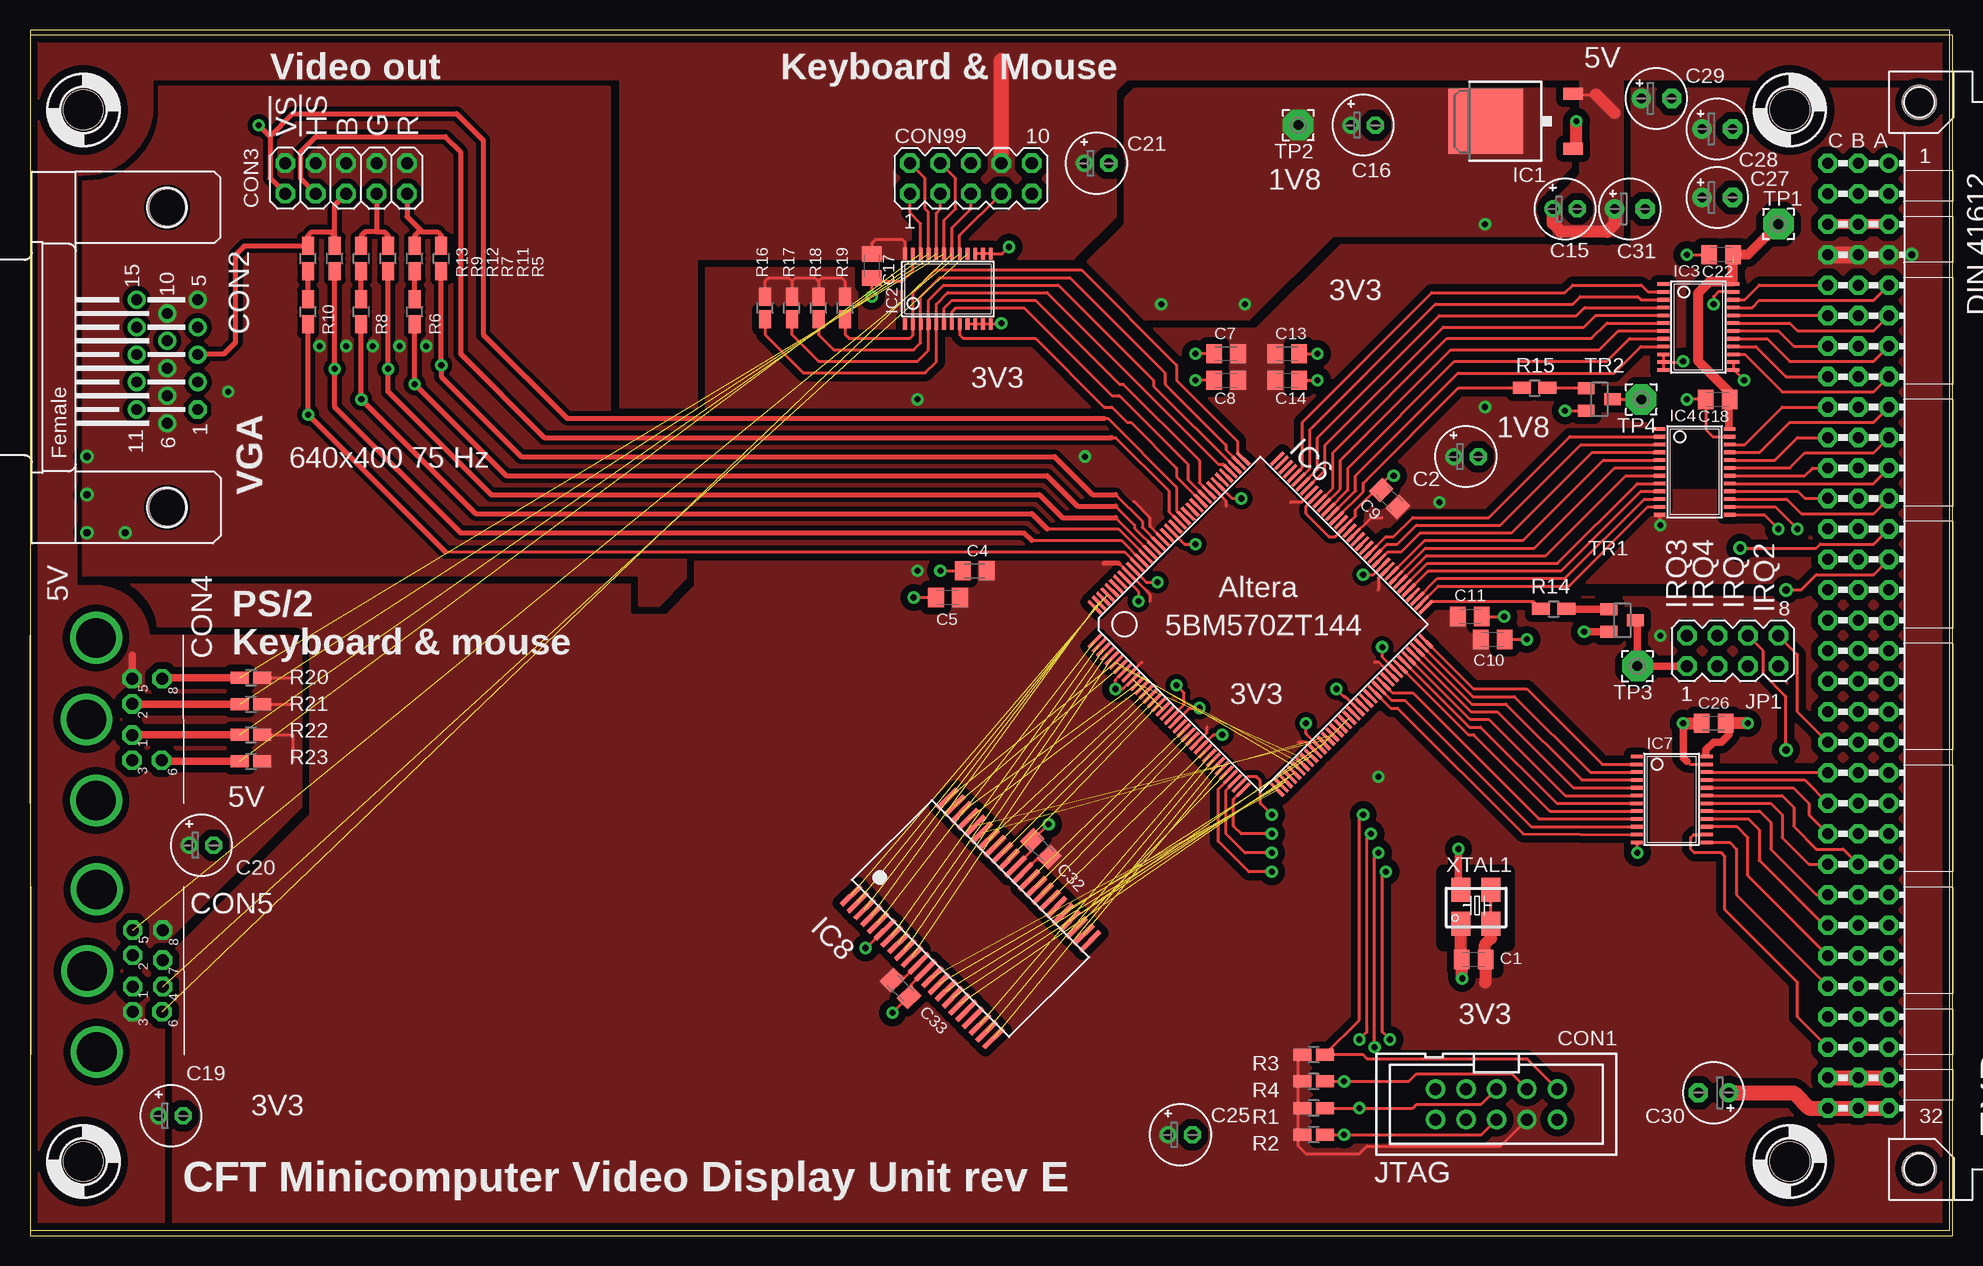
[diagram p3: board, top side]
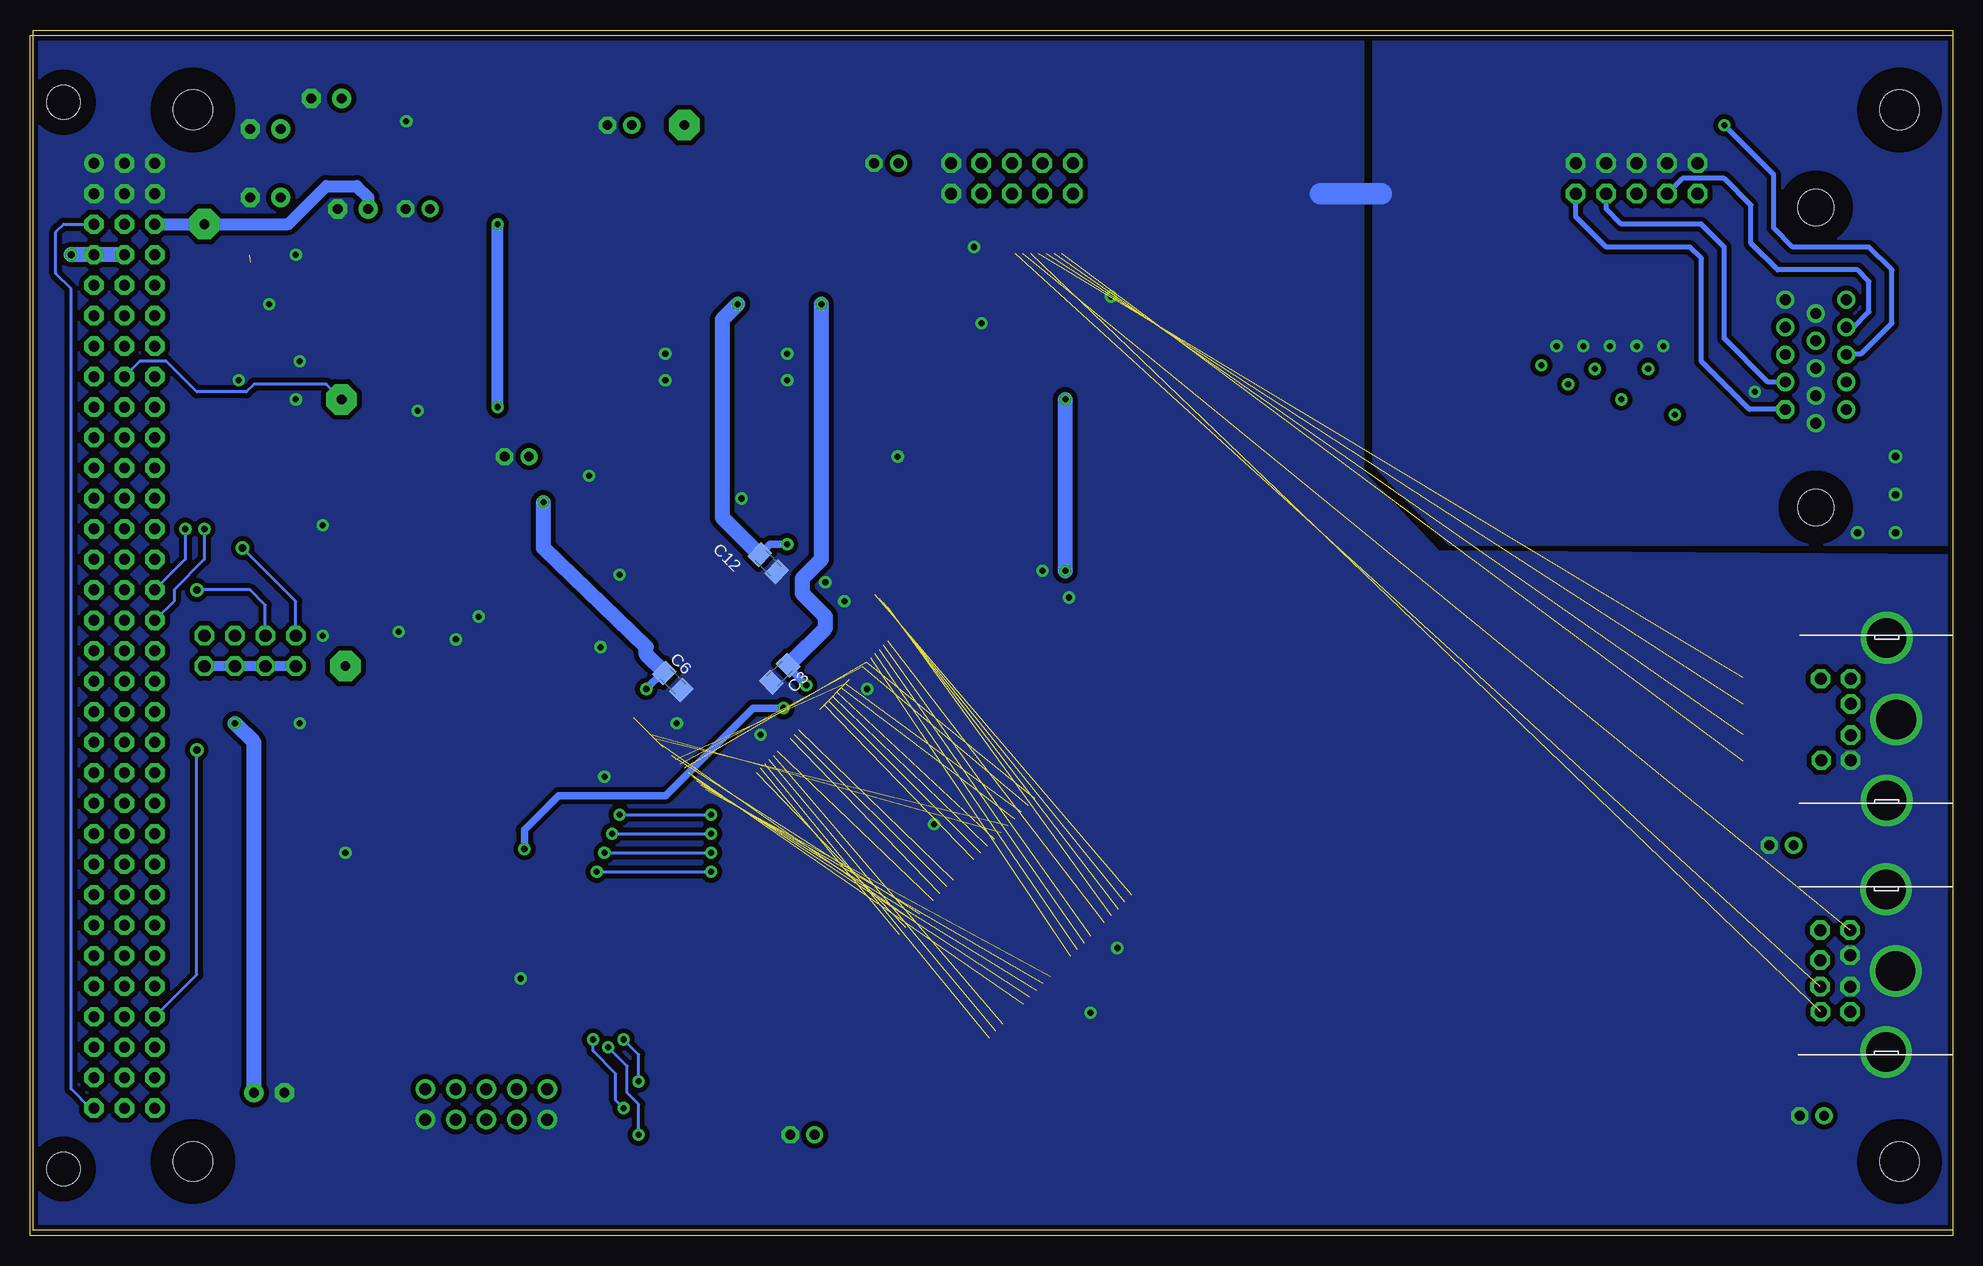
[diagram p4: board, bottom side, seen from below]

Size 160 x 100 mm. Coordinates in mm from the lower left corner, seen from the top.
Outline: 0,0 160,0 160,100 0,100 0,0
Copper layers (1*16): Top 0.035mm / dielectric 1.5mm / Bottom 0.035mm
Design rules "SparkFun *": minimum track width 8mil, minimum drill 20mil, track to track 6mil, track to pad 6mil, pad to pad 6mil, via to via 6mil, smd to smd 6mil, copper to edge 10mil, drill to drill 8mil, minimum pad ring 12mil, minimum via ring 10mil, stop-mask expansion 4mil, vias tented up to drill 25mil, thermal gap 10mil
tRestrict: area 117.8,23.8 to 123.2,29.8; area 120.7,21.6 to 122.2,23.5

### Footprints (pad centres in the part's own frame; a part is rotated, then mirrored left to right if it is on the bottom)
C0805K = smd 1.3 x 1.6: 1 -1,0; 2 1,0
E2-5 = drill 0.813 pad 1.27 round: + -1.016,0 | drill 0.813 pad 1.27 octagon: - 1.016,0
E2,5-5 = drill 0.813 pad 1.6 round: + -1.27,0 | drill 0.813 pad 1.6 octagon: - 1.27,0
SHROUDED-HEADER-2X5-2.5MM = drill 1 pad 1.422 round: 1 -5.08,-1.27; 2 -5.08,1.27; 3 -2.54,-1.27; 4 -2.54,1.27; 5 0,-1.27; 6 0,1.27; 7 2.54,-1.27; 8 2.54,1.27; 9 5.08,-1.27; 10 5.08,1.27
HDF15H = drill 0.9 octagon: 1 4.329,2.54 | drill 0.9 round: 2 2.043,2.54; 3 -0.243,2.54; 4 -2.529,2.54; 5 -4.815,2.54; 6 5.472,0; 7 3.186,0; 8 0.9,0; 9 -1.386,0; 10 -3.672,0; 11 4.329,-2.54; 12 2.043,-2.54; 13 -0.243,-2.54; 14 -2.529,-2.54; 15 -4.815,-2.54 | hole 3: -12.5,0; 12.5,0
2X05 = drill 1.016 octagon: 1 -5.08,-1.27; 2 -5.08,1.27; 3 -2.54,-1.27; 4 -2.54,1.27; 5 0,-1.27; 6 0,1.27; 7 2.54,-1.27; 8 2.54,1.27; 9 5.08,-1.27; 10 5.08,1.27
M_DIN6 = drill 1 pad 1.422 octagon: 1 -1.3,-3.75; 2 1.3,-3.75; 3 -3.4,-3.75; 5 3.4,-3.75; 6 -3.4,-6.2; 8 3.4,-6.25 | drill 3.3 pad 3.5 round: SH1 6.8,-0.75; SH2 0,0.05; SH3 -6.75,-0.75
M_DIN8 = drill 1 pad 1.422 octagon: 1 -1.3,-3.8; 2 1.3,-3.8; 3 -3.4,-3.8; 4 -1.3,-6.3; 5 3.4,-3.8; 6 -3.4,-6.25; 7 0.9,-6.3; 8 3.4,-6.3 | drill 3.3 pad 3.5 round: SH1 6.8,-0.8; SH2 0,0; SH3 -6.75,-0.8
MA05-2 = drill 1.016 octagon: 1 -5.08,-1.27; 2 -5.08,1.27; 3 -2.54,-1.27; 4 -2.54,1.27; 5 0,-1.27; 6 0,1.27; 7 2.54,-1.27; 8 2.54,1.27; 9 5.08,-1.27; 10 5.08,1.27
VG96K = drill 0.914 pad 1.6 round: A1 154.94,39.37 | drill 0.914 pad 1.6 octagon: A2 154.94,36.83; A3 154.94,34.29; A4 154.94,31.75; A5 154.94,29.21; A6 154.94,26.67; A7 154.94,24.13; A8 154.94,21.59; A9 154.94,19.05; A10 154.94,16.51; A11 154.94,13.97; A12 154.94,11.43; A13 154.94,8.89; A14 154.94,6.35; A15 154.94,3.81; A16 154.94,1.27; A17 154.94,-1.27; A18 154.94,-3.81; A19 154.94,-6.35; A20 154.94,-8.89; A21 154.94,-11.43; A22 154.94,-13.97; A23 154.94,-16.51; A24 154.94,-19.05; A25 154.94,-21.59; A26 154.94,-24.13; A27 154.94,-26.67; A28 154.94,-29.21; A29 154.94,-31.75; A30 154.94,-34.29; A31 154.94,-36.83; A32 154.94,-39.37; B1 152.4,39.37; B2 152.4,36.83; B3 152.4,34.29; B4 152.4,31.75; B5 152.4,29.21; B6 152.4,26.67; B7 152.4,24.13; B8 152.4,21.59; B9 152.4,19.05; B10 152.4,16.51; B11 152.4,13.97; B12 152.4,11.43; B13 152.4,8.89; B14 152.4,6.35; B15 152.4,3.81; B16 152.4,1.27; B17 152.4,-1.27; B18 152.4,-3.81; B19 152.4,-6.35; B20 152.4,-8.89; B21 152.4,-11.43; B22 152.4,-13.97; B23 152.4,-16.51; B24 152.4,-19.05; B25 152.4,-21.59; B26 152.4,-24.13; B27 152.4,-26.67; B28 152.4,-29.21; B29 152.4,-31.75; B30 152.4,-34.29; B31 152.4,-36.83; B32 152.4,-39.37; C1 149.86,39.37; C2 149.86,36.83; C3 149.86,34.29; C4 149.86,31.75; C5 149.86,29.21; C6 149.86,26.67; C7 149.86,24.13; C8 149.86,21.59; C9 149.86,19.05; C10 149.86,16.51; C11 149.86,13.97; C12 149.86,11.43; C13 149.86,8.89; C14 149.86,6.35; C15 149.86,3.81; C16 149.86,1.27; C17 149.86,-1.27; C18 149.86,-3.81; C19 149.86,-6.35; C20 149.86,-8.89; C21 149.86,-11.43; C22 149.86,-13.97; C23 149.86,-16.51; C24 149.86,-19.05; C25 149.86,-21.59; C26 149.86,-24.13; C27 149.86,-26.67; C28 149.86,-29.21; C29 149.86,-31.75; C30 149.86,-34.29; C31 149.86,-36.83; C32 149.86,-39.37 | hole 2.794: 157.48,44.45; 157.48,-44.45
STANDOFF_28_60 = hole 3.302: 0,0
TO252 = smd 1 x 1.6: 1 -2.28,-4.8; 2 2.28,-4.8 | smd 5.4 x 6.2: 3 0,2.5
TSSOP24@2 = smd 0.305 x 0.991: 1 -3.575,-2.918; 2 -2.925,-2.918; 3 -2.275,-2.918; 4 -1.625,-2.918; 5 -0.975,-2.918; 6 -0.325,-2.918; 7 0.325,-2.918; 8 0.975,-2.918; 9 1.625,-2.918; 10 2.275,-2.918; 11 2.925,-2.918; 12 3.575,-2.918; 13 3.575,2.918; 14 2.925,2.918; 15 2.275,2.918; 16 1.625,2.918; 17 0.975,2.918; 18 0.325,2.918; 19 -0.325,2.918; 20 -0.975,2.918; 21 -1.625,2.918; 22 -2.275,2.918; 23 -2.925,2.918; 24 -3.575,2.918
TSSOP24@1 = smd 0.305 x 0.991: 1 -3.575,-2.918; 2 -2.925,-2.918; 3 -2.275,-2.918; 4 -1.625,-2.918; 5 -0.975,-2.918; 6 -0.325,-2.918; 7 0.325,-2.918; 8 0.975,-2.918; 9 1.625,-2.918; 10 2.275,-2.918; 11 2.925,-2.918; 12 3.575,-2.918; 13 3.575,2.918; 14 2.925,2.918; 15 2.275,2.918; 16 1.625,2.918; 17 0.975,2.918; 18 0.325,2.918; 19 -0.325,2.918; 20 -0.975,2.918; 21 -1.625,2.918; 22 -2.275,2.918; 23 -2.925,2.918; 24 -3.575,2.918
TQFP144 = smd 0.27 x 1.5: 1 -8.75,-10.75; 2 -8.25,-10.75; 3 -7.75,-10.75; 4 -7.25,-10.75; 5 -6.75,-10.75; 6 -6.25,-10.75; 7 -5.75,-10.75; 8 -5.25,-10.75; 9 -4.75,-10.75; 10 -4.25,-10.75; 11 -3.75,-10.75; 12 -3.25,-10.75; 13 -2.75,-10.75; 14 -2.25,-10.75; 15 -1.75,-10.75; 16 -1.25,-10.75; 17 -0.75,-10.75; 18 -0.25,-10.75; 19 0.25,-10.75; 20 0.75,-10.75; 21 1.25,-10.75; 22 1.75,-10.75; 23 2.25,-10.75; 24 2.75,-10.75; 25 3.25,-10.75; 26 3.75,-10.75; 27 4.25,-10.75; 28 4.75,-10.75; 29 5.25,-10.75; 30 5.75,-10.75; 31 6.25,-10.75; 32 6.75,-10.75; 33 7.25,-10.75; 34 7.75,-10.75; 35 8.25,-10.75; 36 8.75,-10.75; 73 8.75,10.75; 74 8.25,10.75; 75 7.75,10.75; 76 7.25,10.75; 77 6.75,10.75; 78 6.25,10.75; 79 5.75,10.75; 80 5.25,10.75; 81 4.75,10.75; 82 4.25,10.75; 83 3.75,10.75; 84 3.25,10.75; 85 2.75,10.75; 86 2.25,10.75; 87 1.75,10.75; 88 1.25,10.75; 89 0.75,10.75; 90 0.25,10.75; 91 -0.25,10.75; 92 -0.75,10.75; 93 -1.25,10.75; 94 -1.75,10.75; 95 -2.25,10.75; 96 -2.75,10.75; 97 -3.25,10.75; 98 -3.75,10.75; 99 -4.25,10.75; 100 -4.75,10.75; 101 -5.25,10.75; 102 -5.75,10.75; 103 -6.25,10.75; 104 -6.75,10.75; 105 -7.25,10.75; 106 -7.75,10.75; 107 -8.25,10.75; 108 -8.75,10.75 | smd 1.5 x 0.27: 37 10.75,-8.75; 38 10.75,-8.25; 39 10.75,-7.75; 40 10.75,-7.25; 41 10.75,-6.75; 42 10.75,-6.25; 43 10.75,-5.75; 44 10.75,-5.25; 45 10.75,-4.75; 46 10.75,-4.25; 47 10.75,-3.75; 48 10.75,-3.25; 49 10.75,-2.75; 50 10.75,-2.25; 51 10.75,-1.75; 52 10.75,-1.25; 53 10.75,-0.75; 54 10.75,-0.25; 55 10.75,0.25; 56 10.75,0.75; 57 10.75,1.25; 58 10.75,1.75; 59 10.75,2.25; 60 10.75,2.75; 61 10.75,3.25; 62 10.75,3.75; 63 10.75,4.25; 64 10.75,4.75; 65 10.75,5.25; 66 10.75,5.75; 67 10.75,6.25; 68 10.75,6.75; 69 10.75,7.25; 70 10.75,7.75; 71 10.75,8.25; 72 10.75,8.75; 109 -10.75,8.75; 110 -10.75,8.25; 111 -10.75,7.75; 112 -10.75,7.25; 113 -10.75,6.75; 114 -10.75,6.25; 115 -10.75,5.75; 116 -10.75,5.25; 117 -10.75,4.75; 118 -10.75,4.25; 119 -10.75,3.75; 120 -10.75,3.25; 121 -10.75,2.75; 122 -10.75,2.25; 123 -10.75,1.75; 124 -10.75,1.25; 125 -10.75,0.75; 126 -10.75,0.25; 127 -10.75,-0.25; 128 -10.75,-0.75; 129 -10.75,-1.25; 130 -10.75,-1.75; 131 -10.75,-2.25; 132 -10.75,-2.75; 133 -10.75,-3.25; 134 -10.75,-3.75; 135 -10.75,-4.25; 136 -10.75,-4.75; 137 -10.75,-5.25; 138 -10.75,-5.75; 139 -10.75,-6.25; 140 -10.75,-6.75; 141 -10.75,-7.25; 142 -10.75,-7.75; 143 -10.75,-8.25; 144 -10.75,-8.75
TSOP44-T2 = smd 0.406 x 2.286: 1 -8.4,-5.7; 2 -7.6,-5.7; 3 -6.8,-5.7; 4 -6,-5.7; 5 -5.2,-5.7; 6 -4.4,-5.7; 7 -3.6,-5.7; 8 -2.8,-5.7; 9 -2,-5.7; 10 -1.2,-5.7; 11 -0.4,-5.7; 12 0.4,-5.7; 13 1.2,-5.7; 14 2,-5.7; 15 2.8,-5.7; 16 3.6,-5.7; 17 4.4,-5.7; 18 5.2,-5.7; 19 6,-5.7; 20 6.8,-5.7; 21 7.6,-5.7; 22 8.4,-5.7; 23 8.4,5.7; 24 7.6,5.7; 25 6.8,5.7; 26 6,5.7; 27 5.2,5.7; 28 4.4,5.7; 29 3.6,5.7; 30 2.8,5.7; 31 2,5.7; 32 1.2,5.7; 33 0.4,5.7; 34 -0.4,5.7; 35 -1.2,5.7; 36 -2,5.7; 37 -2.8,5.7; 38 -3.6,5.7; 39 -4.4,5.7; 40 -5.2,5.7; 41 -6,5.7; 42 -6.8,5.7; 43 -7.6,5.7; 44 -8.4,5.7
MA04-2 = drill 1.016 octagon: 1 -3.81,-1.27; 2 -3.81,1.27; 3 -1.27,-1.27; 4 -1.27,1.27; 5 1.27,-1.27; 6 1.27,1.27; 7 3.81,-1.27; 8 3.81,1.27
R0805W = smd 1.5 x 1: 1 -0.94,0; 2 0.94,0
R0805W' = smd 1.5 x 1: 1 -1.052,0; 2 1.052,0
2,54/0,8 = drill 0.813 pad 2.54 octagon: 1 0,0
SOT23 = smd 1 x 1.4: 1 -0.95,-1.1; 2 0.95,-1.1; 3 0,1.1
CRYSTAL-SMD-5X3.2MM = smd 1.6 x 2: 1 1.125,-1.475; 2 -1.375,-1.475; 3 -1.375,1.35; 4 1.125,1.35

### Placement (x,y rotation side)
C1  120.33,22.54 0 top
C2  119.7,64.45 0 top
C3  97.79,46.35 45 bottom
C4  78.74,54.93 0 top
C5  76.52,52.7 180 top
C6  106.68,45.72 135 bottom
C7  99.69,73.03 0 top
C8  99.69,70.8 180 top
C9  113.35,60.96 315 top
C10  121.92,49.21 180 top
C11  120.02,51.12 0 top
C12  98.74,55.56 135 bottom
C13  104.78,73.03 180 top
C14  104.78,70.8 0 top
C15  127.95,85.09 0 top
C16  111.12,92.08 0 top
C17  70.17,80.33 270 top
C18  140.65,69.22 180 top
C19  11.75,9.53 0 top
C20  14.29,32.07 0 top
C21  88.9,88.9 0 top
C22  140.97,81.28 180 top
C25  95.89,7.94 0 top
C26  140.34,42.23 180 top
C27  140.65,86.04 0 top
C28  140.65,91.76 0 top
C29  135.57,94.3 0 top
C30  140.34,11.43 180 top
C31  133.35,85.09 0 top
C32  84.24,31.8 135 top
C33  72.56,20.13 315 top
CON1  122.24,10.48 180 top
CON2  11.43,72.71 270 top
CON3  26.35,87.63 180 top
CON4  4.76,42.55 90 top
CON5  4.76,21.59 90 top
CON99  78.42,87.63 0 top
EXP  0,49.53 0 top
H1  4.45,93.34 0 top
H2  146.69,93.34 0 top
H3  146.69,5.71 0 top
H4  4.45,5.71 0 top
IC1  123.83,92.39 90 top
IC2  IDTQS3861PA  [TSSOP24@2]  76.52,78.42 0 top
IC3  IDTQS3861PA  [TSSOP24@1]  139.06,75.25 270 top
IC4  IDTQS3861PA  [TSSOP24@1]  138.75,63.18 270 top
IC6  102.55,50.48 315 top
IC7  IDTQS3861PA  [TSSOP24@1]  136.84,35.88 270 top
IC8  78.4,25.97 315 top
JP1  141.92,48.26 0 top
R1  107,10.16 180 top
R2  107,7.94 180 top
R3  107,14.61 180 top
R4  107,12.38 180 top
R5  412R  [R0805W']  34.29,80.96 90 top
R6  412R  [R0805W']  32.07,76.52 90 top
R7  412R  [R0805W']  29.84,80.96 90 top
R8  412R  [R0805W']  27.62,76.52 90 top
R9  412R  [R0805W']  25.4,80.96 90 top
R10  412R  [R0805W']  23.18,76.52 90 top
R11  412R  [R0805W']  32.07,80.96 90 top
R12  412R  [R0805W']  27.62,80.96 90 top
R13  412R  [R0805W']  23.18,80.96 90 top
R14  4k7  [R0805W']  127,51.75 0 top
R15  4k7  [R0805W']  125.41,70.17 0 top
R16  61.28,76.83 90 top
R17  63.5,76.83 90 top
R18  65.72,76.83 90 top
R19  67.94,76.83 90 top
R20  18.41,46.04 0 top
R21  18.41,43.81 0 top
R22  18.41,41.27 0 top
R23  18.41,39.05 0 top
TP1  145.73,83.82 0 top
TP2  105.73,92.08 180 top
TP3  133.99,46.99 180 top
TP4  134.3,69.22 180 top
TR1  132.72,50.8 270 top
TR2  130.81,69.22 270 top
U$1  SIGNATURESILK  [SIGNATURE]  41.91,-18.73 0 top  (outside the outline)
U$2  19.37,-21.59 0 top  (outside the outline)
XTAL1  120.65,26.99 0 top

### Tracks (layer width: path | path; a pad name or v marks a point on that pad's centre or on a via)
!HS  (via drill 0.51)
  Top 0.254: IC6.123 95.57,59.94 95.57,61.91 89.85,67.63 89.53,67.63
  Top 0.406: 20,91.12 21.91,93.03 35.56,93.03 37.78,90.81 37.78,74.61 44.77,67.63 89.53,67.63 | CON3.10 20,87.63 20,91.12 | v19.05,92.08 20,91.12
  Bottom 0.254: CON2.13 8.82,73.03
  Bottom 0.406: 8.82,73.03 7.62,73.03 5.08,75.56 5.08,80.01 6.99,81.92 13.34,81.92 14.92,83.5 14.92,87.95 v19.05,92.08
!IODEV1XX
  Top 0.254: IC7.19 146.04,36.2 147,35.24 147,33.66 148.91,31.75 151.13,31.75 EXP.B24
!IODEV1XX-3V3
  Top 0.254: IC6.69 120.11,43.18 122.33,43.18 128.66,36.85 IC7.5
!IRQ  (via drill 0.61)
  Top 0.254: JP1.6 144.46,48.26 144.46,46.35 146.37,44.45 v146.37,40.01
  Bottom 0.254: v146.37,40.01 146.37,21.27 EXP.C29
!IRQ2
  Top 0.254: JP1.8 147.32,47.94 147.32,43.18 EXP.C20
!IRQ3  (via drill 0.61)
  Top 0.254: v142.56,56.83 148.91,56.83 149.22,57.15 153.67,57.15 EXP.A13
  Bottom 0.254: JP1.2 138.11,52.39 v142.56,56.83
!IRQ4  (via drill 0.61)
  Top 0.254: EXP.A14 153.67,54.61 148.91,54.61 147.64,53.34 v146.37,53.34
  Bottom 0.254: v146.37,53.34 141.92,53.34 140.65,52.07 JP1.4
!LB  (1 unrouted)
!PR  (1 unrouted)
!PW  (1 unrouted)
!R  (via drill 0.51)
  Top 0.254: IC4.14 145.48,60.26 v147.32,58.42
  Bottom 0.254: v147.32,58.42 147.32,55.88 EXP.C15
!R-3V3
  Top 0.254: IC6.75 117.32,54.29 127.95,54.29 134.57,60.91 IC4.10
!RESET
  Top 0.254: IC7.14 138.68,32.95 138.43,32.7 138.43,31.75 138.75,31.43 140.97,31.43 141.29,31.11 141.29,26.67 147.32,20.64 147.32,17.78 EXP.C30
!RESET-3V3
  Top 0.254: IC6.61 113.5,44.13 114.62,44.13 125.15,33.6 IC7.10
!UB  (1 unrouted)
!VS
  Top 0.254: IC6.124 94.93,59.87 94.93,61.59 90.49,66.04 90.17,66.04
  Top 0.406: CON3.8 22.54,87.63 22.54,89.85 23.81,91.12 34.61,91.12 35.88,89.85 35.88,73.03 42.86,66.04 90.17,66.04
  Bottom 0.406: CON3.8 22.54,87.63 19.05,87.63 16.83,85.41 16.83,82.23 14.61,80.01 7.94,80.01 6.99,79.06 6.99,76.51 8.26,75.24 CON2.14
!W  (via drill 0.51)
  Top 0.254: IC4.13 144.54,59.61 v145.73,58.42
  Bottom 0.254: v145.73,58.42 145.73,55.88 148.27,53.34 148.27,52.39 EXP.C16
!W-3V3
  Top 0.254: IC4.11 134.87,60.26 128.27,53.66 117.39,53.66 IC6.74
!WS
  Top 0.254: TR2.3 TP4.1
  Bottom 0.254: TP4.1 135.57,70.48 141.6,70.48 142.24,69.85 146.37,69.85 148.91,72.39 151.13,72.39 EXP.B8
+3V3  (via drill 0.51, 0.6)
  Top 0.254: R4.2 106.05,12.38 105.73,12.7 | 105.73,12.7 105.73,14.29 106.05,14.61 R3.2 | 105.73,12.7 105.73,10.48 106.05,10.16 | 106.05,10.16 R1.2 | 106.05,10.16 105.73,9.84 105.73,8.26 106.05,7.94 R2.2 | R2.2 105.74,7.95 | 105.73,7.62 105.73,6.99 106.36,6.35 110.81,6.35 111.44,6.99 122.56,6.99 CON1.4 | 105.73,7.62 105.41,7.94 | 105.73,7.62 105.74,7.62 R2.2 | IC6.9 92.66,47.31 92.71,47.31 | IC6.64 112.44,47.31 112.08,47.31 | IC6.82 112.39,54.31 112.39,53.34 | IC6.100 106,60.64 105.09,60.64 | IC6.116 99.69,60.77 99.69,60.33 | 93.34,52.39 93.34,52.97 IC6.136 90.75,55.56 | R16.2 61.28,79.06 61.59,79.38 63.18,79.38 63.5,79.06 | 63.5,79.06 R17.2 | 63.5,79.06 63.82,79.38 65.41,79.38 65.72,79.06 | 65.72,79.06 R18.2 | 65.72,79.06 66.04,79.38 67.63,79.38 67.94,79.06 R19.2 | IC6.25 98.11,41.44 98.11,41.91 | IC6.46 106.38,40.64 105.73,40.64 | XTAL1.1 XTAL1.4 | IC8.11 72.28,20.41 C33.1 | IC8.33 84.32,31.32 C32.1
  Top 0.406: 90.75,55.56 89.53,55.56
  Top 1.016: XTAL1.1 121.78,24.3 121.28,23.81 121.28,22.59 C1.2 121.33,20.68 121.28,20.64
  Top 1.422: EXP.C4 EXP.B4
  Bottom 1.27: v73.98,54.93 v73.98,69.22 | EXP.B4 v156.84,81.28
  pour Top (isolate 0.61, rank 6, no thermals): 160.34,95.25 160.34,-0.32 4.13,-0.32 4.45,56.52 48.9,56.2 48.9,95.25
  pour Top (isolate 0.406, no thermals): 102.55,64.45 89.22,51.12 89.22,49.85 102.55,36.51 116.52,50.48
+12V
  Top 1.27: EXP.C31 EXP.B31 EXP.A31
AB0
  Top 0.254: IC3.21 143.55,76.87 144.15,77.47 153.67,77.47 EXP.A5
AB0-3V3
  Top 0.254: IC3.3 134.25,77.52 133.99,77.79 129.22,77.79 128.59,77.15 117.16,77.15 106.68,66.67 106.68,63.45 IC6.103
AB1
  Top 0.254: IC3.19 146.68,75.57 147.32,74.93 153.67,74.93 EXP.A6
AB1-3V3
  Top 0.254: IC6.101 107.95,63.3 107.95,65.41 117.79,75.25 129.54,75.25 130.51,76.22 IC3.5
AB2
  Top 0.254: IC3.17 144.8,74.27 146.69,72.39 153.67,72.39 EXP.A7
AB2-3V3
  Top 0.254: IC6.97 109.22,61.75 109.22,64.14 118.42,73.33 130.8,73.33 132.39,74.92 IC3.7
AB3
  Top 0.254: IC3.15 142.93,72.97 146.05,69.85 153.67,69.85 EXP.A8
AB3-3V3
  Top 0.254: IC6.95 110.49,61.6 110.49,62.87 119.03,71.4 132.04,71.4 134.26,73.62 IC3.9
AB4
  Top 0.254: IC4.21 144.18,64.81 146.69,67.31 153.67,67.31 EXP.A9
AB4-3V3
  Top 0.254: IC4.3 129.28,65.46 122.56,58.74 115.57,58.74 113.98,57.15 113.11,57.15 IC6.85
AB5
  Top 0.254: IC4.19 146.69,63.51 147.96,64.77 153.67,64.77 EXP.A10
AB5-3V3
  Top 0.254: IC6.81 116.25,57.47 124.46,57.47 131.15,64.16 IC4.5
AB6
  Top 0.254: IC4.17 153.65,62.21 EXP.A11
AB6-3V3
  Top 0.254: IC6.79 116.4,56.2 126.36,56.2 133.03,62.86 IC4.7
AB7
  Top 0.254: IC4.15 146.42,60.91 147.64,59.69 153.67,59.69 EXP.A12
AB7-3V3
  Top 0.254: IC6.77 116.54,54.93 127.64,54.93 134.26,61.56 IC4.9
B0  (via drill 0.51)
  Top 0.254: IC6.133 90.97,57.47 83.5,57.47
  Top 0.406: R9.1 v25.4,71.75 25.4,68.58 35.88,58.1 82.87,58.1 83.5,57.47
B1  (via drill 0.51)
  Top 0.254: IC6.134 91.22,56.52 34.61,56.52
  Top 0.406: R10.1 v23.18,67.94 34.61,56.52
BLUE
  Top 0.406: CON3.6 25.4,85.41 25.4,82.87 | 25.4,82.55 R9.2 25.4,82.87 | 25.4,82.87 25.08,83.19 23.5,83.19 23.18,82.87 R13.2 17.88,82.02 17.14,81.28 17.14,73.98 16.19,73.03 14.04,73.03 CON2.3
CLK  (via drill 0.51)
  Top 0.254: IC6.20 96.63,43.5 v97.47,43.5
  Top 0.61: XTAL1.3 119.06,28.34 v119.06,31.75
  Bottom 0.61: v97.47,43.5 100.01,43.5 107.31,36.2 116.2,36.2 119.06,33.34 v119.06,31.75
DB0
  Top 0.254: IC3.22 142.93,77.52 144.15,78.74 EXP.C5
DB0-3V3
  Top 0.254: IC6.104 106.05,63.52 106.05,67.31 116.84,78.11 127.95,78.11 128.59,78.74 134.3,78.74 134.87,78.17 IC3.2
DB1
  Top 0.254: IC3.20 149.84,76.22 EXP.C6
DB1-3V3
  Top 0.254: IC6.102 107.31,63.38 107.31,66.04 117.47,76.2 128.91,76.2 129.58,76.87 IC3.4
DB2
  Top 0.254: IC3.18 145.74,74.92 147,73.66 EXP.C7
DB2-3V3
  Top 0.254: IC6.98 108.58,61.82 108.58,64.77 118.11,74.3 130.16,74.3 131.44,75.57 IC3.6
DB3
  Top 0.254: IC3.16 143.87,73.62 146.37,71.12 EXP.C8
DB3-3V3
  Top 0.254: IC6.96 109.86,61.67 109.86,63.5 118.75,72.39 131.44,72.39 133.33,74.27 IC3.8
DB4
  Top 0.254: IC4.22 142.93,65.46 146.05,68.58 EXP.C9
DB4-3V3
  Top 0.254: IC4.2 128.34,66.11 121.6,59.37 115.25,59.37 113.67,57.78 113.04,57.78 IC6.86
DB5
  Top 0.254: IC4.20 145.44,64.16 147.32,66.04 EXP.C10
DB5-3V3
  Top 0.254: IC4.4 130.21,64.81 123.51,58.1 115.89,58.1 114.3,56.52 113.18,56.52 IC6.84
DB6
  Top 0.254: IC4.18 147.95,62.86 148.59,63.5 EXP.C11
DB6-3V3
  Top 0.254: IC6.80 116.33,56.83 125.41,56.83 132.09,63.51 IC4.6
DB7
  Top 0.254: IC4.16 147.36,61.56 147.96,60.96 EXP.C12
DB7-3V3
  Top 0.254: IC4.8 133.96,62.21 127.32,55.56 116.47,55.56 IC6.78
DB8
  Top 0.254: IC7.22 149.81,38.15 EXP.C21
DB8-3V3
  Top 0.254: IC6.72 120.32,45.09 124.77,45.09 131.05,38.8 IC7.2
DB9
  Top 0.254: IC7.21 147.92,37.5 EXP.C22
DB9-3V3
  Top 0.254: IC6.71 120.25,44.45 123.75,44.45 130.04,38.15 IC7.3
DB10
  Top 0.254: IC7.20 146.98,36.85 148.27,35.56 148.27,34.61 EXP.C23
DB10-3V3
  Top 0.254: IC6.70 120.18,43.81 123.04,43.81 129.35,37.5 IC7.4
DB11
  Top 0.254: IC7.18 145.1,35.55 146.05,34.61 146.05,32.7 148.27,30.48 EXP.C24
DB11-3V3
  Top 0.254: IC7.6 127.97,36.2 121.62,42.55 121.28,42.55 120.97,42.55 120.04,42.55 IC6.68
DB12
  Top 0.254: IC7.17 144.17,34.9 145.1,33.97 145.1,31.75 148.91,27.94 EXP.C25
DB12-3V3
  Top 0.254: IC6.67 119.96,41.91 120.92,41.91 127.27,35.55 IC7.7
DB13
  Top 0.254: IC7.16 143.23,34.25 144.15,33.34 144.15,30.8 149.22,25.72 149.54,25.4 EXP.C26
DB13-3V3
  Top 0.254: IC6.66 119.89,41.27 120.33,41.27 126.7,34.9 IC7.8
DB14
  Top 0.254: IC7.15 142.29,33.6 143.19,32.7 143.19,29.53 EXP.C27
DB14-3V3
  Top 0.254: IC6.62 113.57,44.77 115.25,44.77 125.77,34.25 IC7.9
DB15
  Top 0.254: IC7.13 141.69,32.3 142.24,31.75 142.24,27.94 EXP.C28
DB15-3V3
  Top 0.254: IC6.60 113.43,43.5 113.98,43.5 124.46,33.02 IC7.11
G0  (via drill 0.51)
  Top 0.254: 90.48,59.37 IC6.131
  Top 0.406: R7.1 v29.84,71.75 29.84,69.85 38.42,61.28 84.14,61.28 86.04,59.37 90.48,59.37
G1  (via drill 0.51)
  Top 0.254: IC6.132 90.73,58.42 84.77,58.42
  Top 0.406: R8.1 v27.62,69.22 37.15,59.69 83.5,59.69 84.14,59.05 84.77,58.42
GND  (via drill 0.51, 0.61)  (2 unrouted)
  Top 0.254: IC1.1 128.85,90.11 arc90 128.91,90.17 128.91,89.85 | C26.2 139.06,42.5 138.79,42.23 | IC6.83 111.98,54.61 v111.12,54.61 | IC6.99 106.36,60.3 106.36,59.69 108.27,57.78 108.79,57.78 IC6.92 110.49,59.48 110.49,60.01 112.39,61.91 | IC6.10 91.92,45.89 91.12,45.09 v90.49,45.09 90.49,45.84 IC6.8 | IC7.12 133.93,31.49 v133.99,31.43 | IC6.128 93.34,58.63 93.34,59.37 92,60.72 | IC3.11 IC3.12 | IC4.23 140.27,66.11 139.7,66.67 139.7,69.17 C18.2 v138.11,69.22 | IC3.23 140.72,78.17 140.34,77.79 v140.34,77.15 | IC2.9 IC2.10 IC2.11 IC2.12 80.9,75.5 v80.96,75.56 | IC2.23 73.59,79.94 72.71,79.06 70.22,79.06 C17.2 69.9,79.06 70.17,79.06 v70.17,77.79 | 112.57,61.91 113.03,61.91 | v142.88,70.8 142,71.67 IC3.13 IC3.14 | IC6.115 100.21,60.96 v100.97,60.96 | v75.88,54.93 C4.1 | C5.2 v73.66,52.7 | IC6.137 92.39,53.22 v92.39,52.39 | IC6.135 93.05,53.98 v93.98,53.98 | C7.1 v97.16,73.03 | C8.2 v97.16,70.8 | C13.1 v107.31,73.03 | C14.2 v107.31,70.8 | IC3.10 IC3.11 | C11.2 v122.87,51.12 | C10.1 v124.78,49.21 | IC6.65 112.71,47.75 v112.71,48.58 | v127.95,68.26 v127.95,68.27 TR2.2 | IC3.11 137.73,72.32 arc90 v137.79,72.39 | 112.39,61.91 112.39,61.91 arc90 C9.1 112.64,61.84 112.57,61.91 | 112.39,61.91 112.57,61.91 | 112.39,61.91 113.35,62.87 v113.67,62.87 | IC6.26 98.65,41.27 v99.38,41.27 | IC6.47 106.36,41.37 v106.36,42.23 | v81.6,81.92 81.02,81.34 IC2.13 IC2.14 IC2.15 | 138.11,39.05 138.36,38.8 IC7.23 | IC4.12 135.83,58.8 v135.89,58.74 | v71.89,18.11 73.43,19.65 C33.2 73.27,19.94 73.46,20.13 73.46,20.46 IC8.12 | v138.11,81.28 C22.2 | IC8.34 83.56,31.7 83.56,32.03 83.75,32.22 C32.2 83.6,32.51 v84.91,33.83 | IC8.6 69.71,23.5 v69.64,23.5
  Top 0.61: TR1.2 v129.54,49.85 | 138.11,39.05 137.79,39.37 v137.79,42.23 | 119.33,21 v119.38,20.95 | C1.1 119.28,22.6
  Top 1.016: v137.79,42.23 138.79,42.23 | v128.91,92.39 128.91,90.39 IC1.1 | 119.12,25.67 XTAL1.2 119.28,22.6 | C1.1 119.33,21
  Bottom 1.778: 47.62,86.36 52.7,86.36
  other vias: 4.76,58.1 7.94,58.1 4.76,61.28 4.76,64.45 112.39,37.78 87.95,64.45 16.51,69.85 24.13,73.66 26.35,73.66 28.57,73.66 30.8,73.66 33.02,73.66 135.89,49.53
  pour Bottom (isolate 0.406, no thermals): 42.86,56.52 49.21,63.18 49.21,100.01 160.02,99.69 160.02,0 0,0 0,56.2
  pour Bottom (isolate 0.406, no thermals): 48.26,99.69 48.26,63.82 41.91,57.15 0,57.15 0,99.69
  pour Top (isolate 0.406, rank 4, no thermals): 48.26,95.25 48.26,67.63 94.3,67.63 94.61,56.52 54.61,56.52 54.61,54.29 52.39,52.07 50.8,52.07 50.8,54.61 4.45,54.61 4.45,95.25
  pour Top (isolate 0.61, rank 6, no thermals): 134.94,61.59 128.27,53.98 154.94,53.98 154.94,61.59
  pour Top (isolate 0.61, rank 6, no thermals): 127.64,52.7 127.64,51.12 132.72,51.12 133.99,49.85 133.99,46.99 145.73,46.99 145.73,39.05 154.94,39.05 154.94,52.7
  pour Top (isolate 0.61, rank 6, no thermals): 108.27,40.96 112.08,44.77 113.67,43.18 114.62,43.18 116.52,41.27 116.52,40.96 114.3,38.73 114.3,29.21 113.35,28.26 112.71,28.89 112.71,29.53 112.39,29.84 112.39,31.43 111.76,32.07 111.76,33.02 111.12,33.66 111.12,34.61 110.17,34.61 110.17,38.42 107.95,40.64
GREEN
  Top 0.406: R12.2 27.62,82.87 27.94,83.19 28.89,83.19 | 28.89,83.19 29.53,83.19 29.84,82.87 R7.2 | CON3.4 28.89,83.19
  Bottom 0.406: CON2.2 15.42,70.67 19.05,74.3 19.05,81.92 20.95,83.82 27.62,83.82 28.89,85.09 CON3.4
KBCLK
  Top 0.254: R19.1 67.94,74.61 68.26,74.3 73.34,74.3 73.59,74.55 IC2.2 73.59,78.11 75.5,80.01 87.63,80.01 95.57,72.07 95.57,70.8 100.65,65.72 100.65,64.76 IC6.109
KBCLK-5V  (1 unrouted)
  Top 0.254: CON4.6 11.05,39.05 | IC2.22 74.24,83.87 73.34,84.77 CON99.1
  Top 0.61: 11.05,39.05 R23.1
KBDAT
  Top 0.254: R18.1 65.72,74.61 66.99,73.34 73.66,73.34 74.24,73.92 IC2.3 74.24,77.79 75.83,79.38 86.68,79.38 94.61,71.44 94.61,70.48 99.69,65.41 99.69,65.01 IC6.110
KBDAT-5V  (1 unrouted)
  Top 0.254: CON4.1 8.54,41.27 | IC2.21 74.89,84.81 74.61,85.09 74.61,87.63 CON99.2
  Top 0.61: 8.54,41.27 R22.1
MSCLK
  Top 0.254: R16.1 61.28,74.61 64.45,71.44 74.61,71.44 75.54,72.37 IC2.5 75.54,77.15 76.5,78.11 84.77,78.11 99.06,63.82 99.47,63.82 IC6.112
MSCLK-5V  (1 unrouted)
  Top 0.254: CON4.8 11.11,46.04 | IC2.19 76.19,84.13 77.15,85.09 77.15,87.63 CON99.4
  Top 0.61: 11.11,46.04 R20.1
MSDAT
  Top 0.254: R17.1 63.5,74.61 65.72,72.39 73.98,72.39 74.89,73.31 IC2.4 74.89,77.47 76.16,78.74 85.72,78.74 93.66,70.8 93.66,70.33 IC6.111
MSDAT-5V  (1 unrouted)
  Top 0.254: 17.46,43.5 17.14,43.81 R21.1 | CON4.2 8.54,43.81 | IC2.20 75.54,84.75 75.88,85.09 CON99.3
  Top 0.61: 8.54,43.81 17.14,43.81
N$1
  Top 0.406: R6.2 R11.1
N$2
  Top 0.406: R8.2 R12.1
N$3
  Top 0.406: R10.2 R13.1
N$6
  Top 0.254: TR2.1 R15.2
N$260
  Top 0.254: TR1.3 133.99,50.8 134.3,50.48
  Top 0.61: JP1.1 TP3.1 133.99,50.63 TR1.3
  Bottom 0.813: JP1.7 JP1.5 JP1.3 JP1.1
N$843
  Top 0.61: R14.2 TR1.1
PA0  (1 unrouted)
PA1  (1 unrouted)
PA2  (1 unrouted)
PA3  (1 unrouted)
PA4  (1 unrouted)
PA5  (2 unrouted)
PA6  (2 unrouted)
PA7  (2 unrouted)
PA8  (1 unrouted)
PA9  (1 unrouted)
PA10  (1 unrouted)
PA11  (1 unrouted)
PA12  (1 unrouted)
PA13  (1 unrouted)
PA14  (1 unrouted)
PD0  (1 unrouted)
PD1  (1 unrouted)
PD2  (1 unrouted)
PD3  (1 unrouted)
PD4  (1 unrouted)
PD5  (1 unrouted)
PD6  (1 unrouted)
PD7  (1 unrouted)
PD8  (1 unrouted)
PD9  (1 unrouted)
PD10  (1 unrouted)
PD11  (1 unrouted)
PD12  (1 unrouted)
PD13  (1 unrouted)
PD14  (1 unrouted)
PD15  (1 unrouted)
R0  (via drill 0.51)
  Top 0.254: IC6.129 92.71,58.56 92.71,59.05 90.49,61.28
  Top 0.406: R5.1 v34.29,72.07 34.29,71.12 40.96,64.45 85.41,64.45 88.58,61.28 90.49,61.28
R1  (via drill 0.51)
  Top 0.254: IC6.130 92.08,58.48 92.08,58.74 90.49,60.33
  Top 0.406: R6.1 v32.07,70.48 39.69,62.87 84.77,62.87 87.31,60.33 90.49,60.33
RED
  Top 0.406: R11.2 32.07,82.87 32.38,83.19 32.7,83.19 | 32.7,83.19 33.97,83.19 34.29,82.87 R5.2 | CON3.2 31.43,84.45 32.7,83.19
  Bottom 0.406: CON2.1 16.94,68.38 20.95,72.39 20.95,80.96 21.91,81.92 28.89,81.92 31.43,84.45 CON3.2
SKBRX
  Top 0.254: IC2.6 76.19,76.83 76.83,77.47 83.82,77.47 90.81,70.48 91.12,70.48 97.47,64.14 97.47,62.28 IC6.117
SKBRX-5V  (1 unrouted)
  Top 0.254: CON99.5 78.42,85.09 76.84,83.51 IC2.18
SKBTX
  Top 0.254: IC2.7 arc-45 76.83,75.52 76.83,76.52 77.15,76.83 82.87,76.83 90.17,69.53 90.81,69.53 96.52,63.82 96.52,62.52 IC6.118
SKBTX-5V  (1 unrouted)
  Top 0.254: CON99.7 77.49,82.89 IC2.17
SMSRX
  Top 0.254: IC2.8 77.49,74.59 77.79,74.3 83.82,74.3 89.53,68.58 90.17,68.58 91.44,67.31 91.76,67.31 95.57,63.5 95.57,62.77 IC6.119
SMSRX-5V  (1 unrouted)
TCK  (via drill 0.51)
  Top 0.254: 107.96,14.63 111.1,14.63 111.44,14.29 124.78,14.29 CON1.1 | IC6.35 101.52,37.78 102.23,37.78 102.55,37.47 102.55,35.56 v103.5,34.61 | v111.12,34.61 110.81,34.29 110.81,17.49 107.95,14.63 107.96,14.63 | 108.27,14.61 R3.1 107.96,14.63
  Bottom 0.254: v111.12,34.61 v103.5,34.61
TDI  (via drill 0.51)
  Top 0.254: IC6.34 99.69,36.66 99.69,33.02 101.28,31.43 v103.5,31.43 | v112.08,15.24 112.08,31.11 v112.39,31.43 | R2.1 v109.54,7.94 120.97,7.94 CON1.6
  Bottom 0.254: v112.39,31.43 v103.5,31.43 | v112.08,15.24 110.49,13.65 110.49,11.43 109.54,10.48 v109.54,7.94
TDO  (via drill 0.51)
  Top 0.254: CON1.3 123.51,13.02 115.57,13.02 114.94,12.38 v109.54,12.38 R4.1 | IC6.36 100.33,35.89 100.33,33.66 100.97,33.02 v103.5,33.02 | v111.76,33.02 111.44,32.7 111.44,16.83 111.44,16.51 v110.81,15.88
  Bottom 0.254: v111.76,33.02 v103.5,33.02 | v110.81,15.88 109.54,14.61 v109.54,12.38
TMS  (via drill 0.51)
  Top 0.254: R1.1 v110.81,10.16 115.25,10.16 115.57,10.48 120.97,10.48 CON1.5 | IC6.33 99.06,36.74 99.06,32.38 101.6,29.84 v103.5,29.84 | v113.35,15.88 112.71,16.51 112.71,29.53 v113.03,29.84
  Bottom 0.254: v113.03,29.84 v103.5,29.84 | v113.35,15.88 113.35,14.92 111.44,13.02 111.44,10.79 v110.81,10.16
VCC  (via drill 0.51)  (1 unrouted)
  Top 0.254: IC7.24 139.76,39.63 139.7,39.69 | C18.1 141.66,69.2 | IC4.24 141.66,66.93 141.6,66.99 | IC2.24 72.94,82.31 72.71,82.55 70.48,82.55 70.17,82.23 C17.1 | R20.2 21.91,46.04 | R21.2 21.91,43.81 | R22.2 21.91,41.27 21.91,39.05 | IC1.2 128.68,94.61 130.49,94.61 | 141.98,81.27 141.98,81.22 | IC3.24 141.98,79 141.92,79.06
  Top 0.61: 141.6,41.96 141.66,41.9 | 141.6,41.96 141.6,41.27 140.97,40.64 140.34,40.64 139.7,40.01 139.7,39.69 | C26.1 141.6,41.96 | 141.92,81.23 C22.1 141.98,81.27 | 141.6,66.99 141.6,69.17 C18.1 | C18.1 141.66,69.23 | C18.1 141.6,69.26 | CON4.5 8.51,47.88
  Top 0.813: EXP.C3 EXP.B3 EXP.A3 | 141.92,80.64 141.92,79.06 140.02,79.06 139.06,78.11 139.06,72.39 141.6,69.85 141.6,69.26 | C22.1 143.19,81.28 TP1.1
  Top 1.016: 132.08,93.08 130.55,94.61 130.49,94.61 | C15.+ 126.94,83.88 127.64,83.19 131.44,83.19 132.08,83.82 C31.+ | v143.19,42.23 C26.1
  Top 1.27: EXP.A32 EXP.B32 EXP.C32 148.27,10.16 147,11.43 C30.+ | CON99.8 80.96,97.47
  Bottom 0.254: EXP.A3 157.48,83.82 158.12,83.19 158.12,79.69 156.84,78.42 156.84,11.75 155.25,10.16 EXP.A32
  Bottom 1.016: EXP.C3 TP1.1 138.75,83.82 135.57,87 133.03,87 132.08,86.04 C31.+
  Bottom 1.27: C30.+ 141.6,40.64 v143.19,42.23
  pour Top (isolate 0.61, rank 3, no thermals): 0,99.38 160.34,99.38 160.34,95.89 10.16,95.89 10.16,93.34 arc-90 3.81,87.95 3.81,53.66 5.08,53.66 arc-90 9.84,49.53 21.27,49.53 arc-90 22.54,48.26 22.54,35.24 11.11,23.81 11.11,0 0,0
  pour Top (isolate 0.61, rank 3, no thermals): 127,97.47 128.91,96.2 129.22,96.2 129.22,87.95 127,85.72 127,82.87 132.72,82.87 132.72,97.47
  pour Top (isolate 0.61, no thermals): 49.21,99.38 49.21,67.94 55.56,67.94 55.56,80.96 87,80.96 90.49,84.45 90.49,94.93 92.08,96.52 92.08,99.38
VCCINT  (via drill 0.51)
  Top 0.254: IC1.3 120.02,92.39 | IC6.90 111.8,59.37 112.71,59.37 | IC6.126 96.24,57.15 v97.16,57.15 | IC6.56 109.65,44.45 109.54,44.45 v108.9,45.09 | IC6.19 96.2,43.78 96.2,44.77 v95.57,45.4
  Bottom 0.254: 99.69,56.52 99.69,56.2 | 99.69,56.52 | C12.2 99.69,56.52 | C3.2 96.84,47.31
  Bottom 0.61: v97.16,57.15 98.57,57.15 C12.2 | C6.2 107.56,46.43 v108.9,45.09 | v95.57,45.4 97.08,46.92 C3.2
  Bottom 1.016: v121.28,68.58 v121.28,83.82
  Bottom 1.27: v117.47,60.64 117.47,56.83 108.9,48.58 108.9,47.94 C6.2 | 96.84,47.31 93.98,50.16 93.98,51.12 95.89,53.02 95.89,54.29 94.3,55.88 v94.3,77.15 | 99.69,56.52 102.55,59.37 102.55,75.88 v101.28,77.15
  pour Top (isolate 0.61, rank 5, no thermals): 131.13,95.25 131.13,82.87 108.58,82.87 101.6,75.88 86.36,75.88 86.36,80.01 88.9,82.55 88.9,92.08 92.08,95.25
  pour Top (isolate 0.61, no thermals): 122.56,73.66 135.25,73.66 135.25,66.04 128.27,66.04 121.6,59.37 115.57,59.05 112.39,56.52 108.9,60.01
VDUINT
  Top 0.254: IC6.73 116.51,52.07 116.52,52.07 116.84,52.39 125.31,52.39 R14.1
WS-3V3
  Top 0.254: R15.1 119.06,70.17 111.12,62.23 111.12,61.53 IC6.94

### Text on the board
tNames: 5V | Video out | Keyboard & Mouse | !VS | !HS | B | G | R | 1V8 | 3V3 | 3V3 | 1V8 | 640x400 75 Hz | VGA | Altera | 5V | IRQ3 | IRQ4 | IRQ | PS/2 | IRQ2 | 5BM570ZT144 | Keyboard & mouse | 3V3 | 5V | 3V3 | 3V3 | JTAG | CFT Minicomputer Video Display Unit rev E | http://www.bedroomlan.org/cft | Sun keyboard & mouse | (c) 2012 AlexiosC